# EasyEDA Pro project TeensySensorBoardV2.eprj, board PCB1
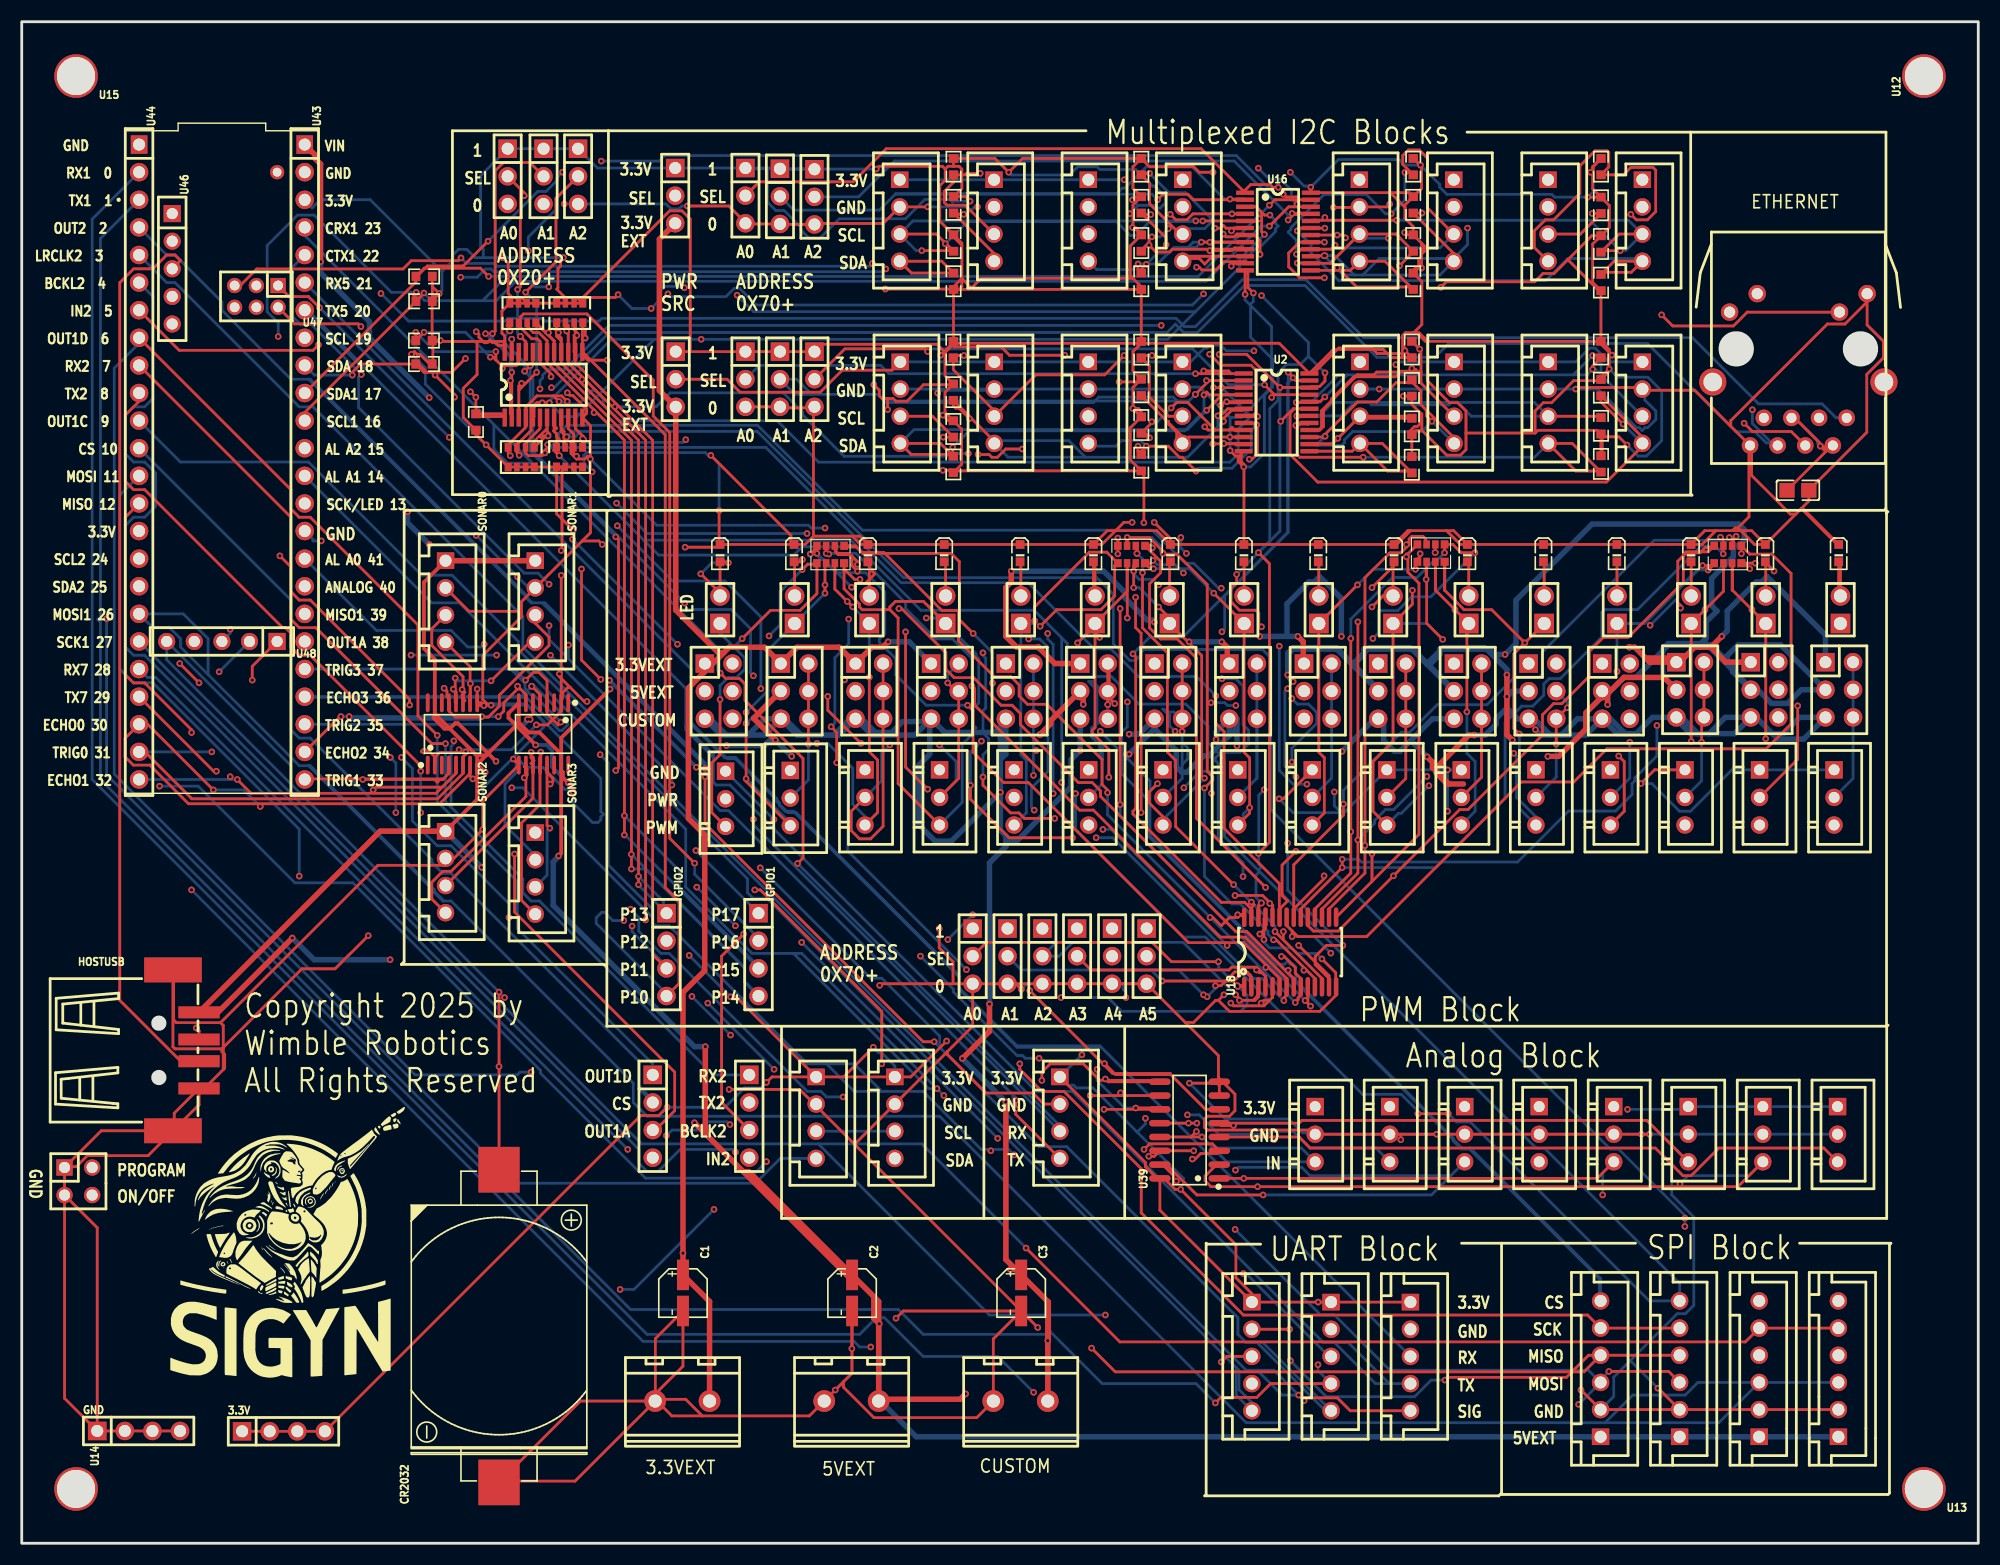
[diagram p9: board, top side]
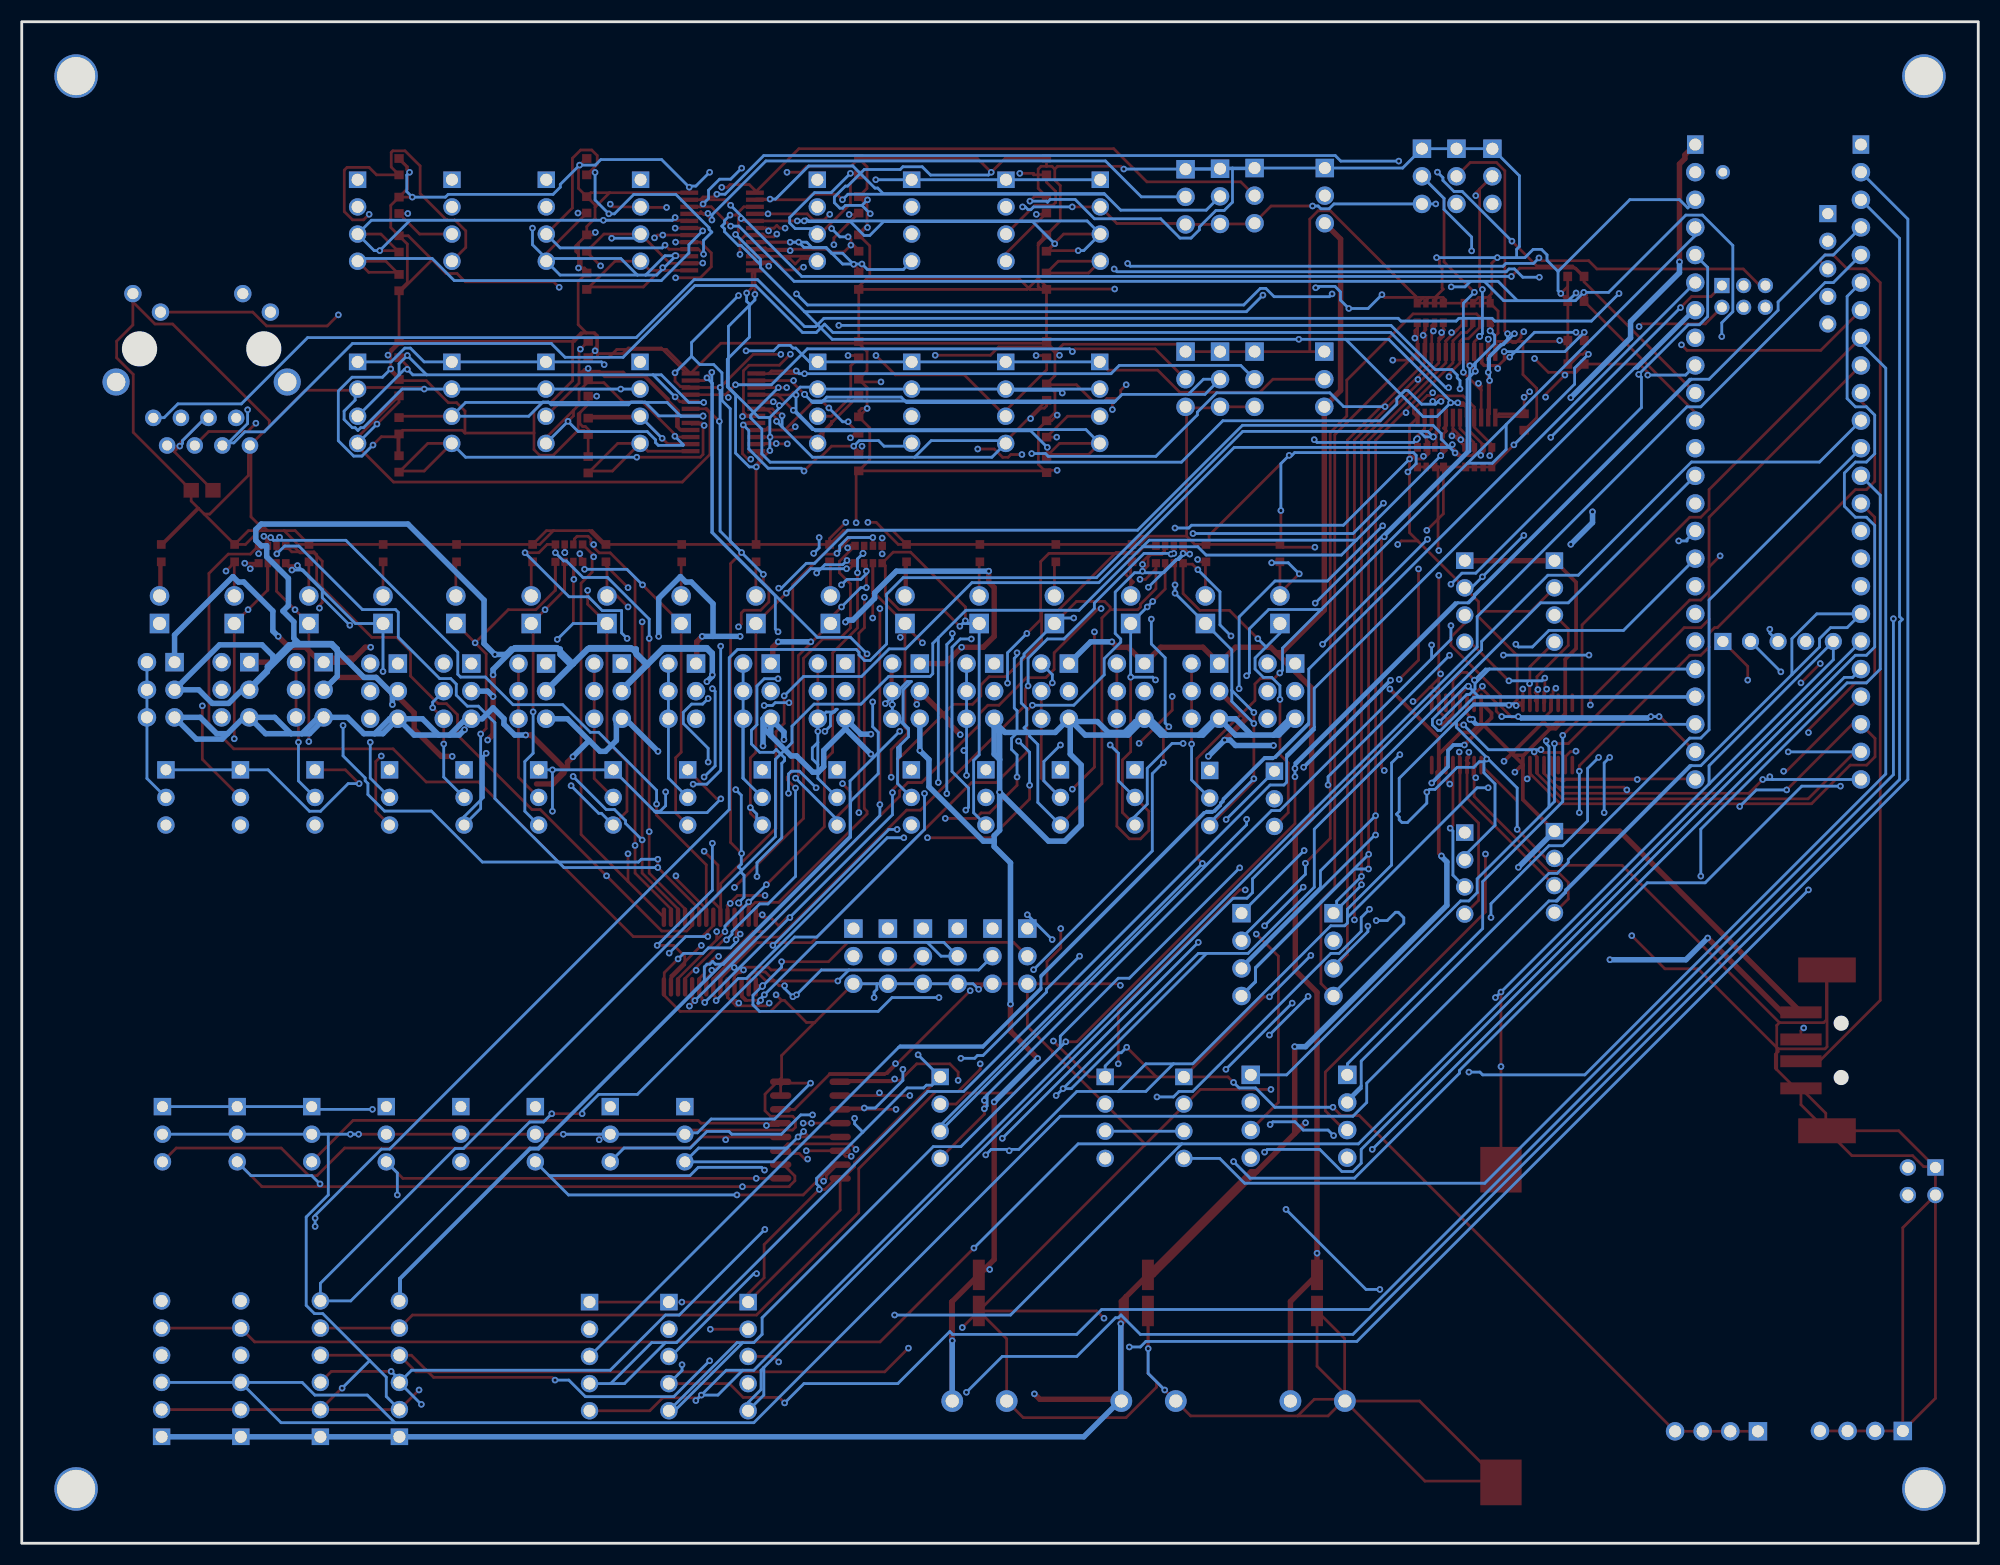
[diagram p10: board, bottom side, seen from below]

Outline 180 x 140 mm; copper layers: Top Layer, Inner1, Inner2, Bottom Layer. Coordinates in mm from the lower left corner of the outline.
Outline path: rectangle 0,140 180,0
Stack: Top Layer 0.035mm Outer layer thickness 1oz / Dielectric1 0.2104mm 7628 RC49% 8.6mil / Inner1 0.0152mm Inner layer thickness / Dielectric2 1.065mm 1.1mm H/HOZ Copper / Inner2 0.0152mm Inner layer thickness / Dielectric3 0.2104mm 7628 RC49% 8.6mil / Bottom Layer 0.035mm Outer layer thickness 1oz

## Design rules (mm)
template: Custom Config
spacing copperThickness1oz (default): track to track 0.102, other pairs 0.152 to 0.3
spacing copperThickness2oz: track to track 0.203, other pairs 0.152 to 0.3
track width copperThickness1oz (default): min 0.127, default 0.254, max 2.54
track width copperThickness2oz: min 0.203, default 0.254, max 2.54
track width trackWidth1: min 0.127, default 0.5, max 2.54
differential pair differentialPair (default): width min 0.127, default 0.254, max 2.54; gap min 0.152, default 0.152
via viaSize (default): diameter min 0.5, default 0.61, max 10; hole min 0.3, default 0.305, max 6.3
net class Power uses trackWidth1
net 3.3VEXT uses trackWidth1
net 5VEXT uses trackWidth1
net CUST uses trackWidth1

## Placement (name value [footprint] x y rotation side)
3.3V  PZ254V-11-04P  [HDR-TH_4P-P2.54-V-M]  24.08 10.3 0 top
3.3VEXT  WJ127-5.0-2P  [CONN-TH_2P-P5.00_CPC3703CTR]  60.77 13.09 0 top
5VEXT  WJ127-5.0-2P  [CONN-TH_2P-P5.00_CPC3703CTR]  76.33 13.09 0 top
C1  10uF  [CAP-SMD_BD4.0-L4.3-W4.3-LS5.0-FD]  60.83 23.03 270 top
C2  10uF  [CAP-SMD_BD4.0-L4.3-W4.3-LS5.0-FD]  76.39 23.03 270 top
C3  10uF  [CAP-SMD_BD4.0-L4.3-W4.3-LS5.0-FD]  91.95 23.03 270 top
C4  100nF  [C0805]  163.41 96.89 0 top
CN10  ZX-XH2.54-4PZZ  [CONN-TH_4P-P2.50_4PIN]  95.5 39.16 270 top
CN11  ZX-XH2.54-4PZZ  [CONN-TH_4P-P2.50_4PIN]  73.09 39.16 270 top
CN12  ZX-XH2.54-4PZZ  [CONN-TH_4P-P2.50_4PIN]  80.32 39.16 270 top
CN14  ZX-XH2.54-4PZZ  [CONN-TH_4P-P2.50_4PIN]  80.82 104.95 270 top
CN15  ZX-XH2.54-4PZZ  [CONN-TH_4P-P2.50_4PIN]  89.47 104.95 270 top
CN16  ZX-XH2.54-4PZZ  [CONN-TH_4P-P2.50_4PIN]  98.12 104.95 270 top
CN17  ZX-XH2.54-4PZZ  [CONN-TH_4P-P2.50_4PIN]  106.78 104.95 270 top
CN18  ZX-XH2.54-4PZZ  [CONN-TH_4P-P2.50_4PIN]  123.11 104.95 270 top
CN19  ZX-XH2.54-4PZZ  [CONN-TH_4P-P2.50_4PIN]  131.78 104.95 270 top
CN20  ZX-XH2.54-4PZZ  [CONN-TH_4P-P2.50_4PIN]  140.44 104.95 270 top
CN21  ZX-XH2.54-4PZZ  [CONN-TH_4P-P2.50_4PIN]  149.1 104.95 270 top
CN56  ZX-XH2.54-3PZZ  [CONN-TH_3P-P2.54_2501S-3P]  167.05 37.64 270 top
CN57  ZX-XH2.54-3PZZ  [CONN-TH_3P-P2.54_2501S-3P]  160.18 37.64 270 top
CN58  ZX-XH2.54-3PZZ  [CONN-TH_3P-P2.54_2501S-3P]  153.32 37.64 270 top
CN59  ZX-XH2.54-3PZZ  [CONN-TH_3P-P2.54_2501S-3P]  146.46 37.64 270 top
CN60  ZX-XH2.54-3PZZ  [CONN-TH_3P-P2.54_2501S-3P]  139.6 37.64 270 top
CN61  ZX-XH2.54-3PZZ  [CONN-TH_3P-P2.54_2501S-3P]  132.75 37.64 270 top
CN62  ZX-XH2.54-3PZZ  [CONN-TH_3P-P2.54_2501S-3P]  125.86 37.64 270 top
CN63  ZX-XH2.54-3PZZ  [CONN-TH_3P-P2.54_2501S-3P]  118.99 37.64 270 top
CN64  ZX-XH2.54-4PZZ  [CONN-TH_4P-P2.50_4PIN]  80.77 121.71 270 top
CN65  ZX-XH2.54-4PZZ  [CONN-TH_4P-P2.50_4PIN]  89.45 121.71 270 top
CN66  ZX-XH2.54-4PZZ  [CONN-TH_4P-P2.50_4PIN]  98.13 121.71 270 top
CN67  ZX-XH2.54-4PZZ  [CONN-TH_4P-P2.50_4PIN]  106.81 121.71 270 top
CN68  ZX-XH2.54-4PZZ  [CONN-TH_4P-P2.50_4PIN]  123.06 121.71 270 top
CN69  ZX-XH2.54-4PZZ  [CONN-TH_4P-P2.50_4PIN]  131.74 121.71 270 top
CN70  ZX-XH2.54-4PZZ  [CONN-TH_4P-P2.50_4PIN]  140.42 121.71 270 top
CN71  ZX-XH2.54-4PZZ  [CONN-TH_4P-P2.50_4PIN]  149.1 121.71 270 top
CN72  ZX-XH2.54-3PZZ  [CONN-TH_3P-P2.54_2501S-3P]  64.75 68.5 270 top
CN73  ZX-XH2.54-3PZZ  [CONN-TH_3P-P2.54_2501S-3P]  70.71 68.57 270 top
CN74  ZX-XH2.54-3PZZ  [CONN-TH_3P-P2.54_2501S-3P]  77.58 68.63 270 top
CN75  ZX-XH2.54-3PZZ  [CONN-TH_3P-P2.54_2501S-3P]  84.44 68.63 270 top
CN76  ZX-XH2.54-3PZZ  [CONN-TH_3P-P2.54_2501S-3P]  91.3 68.63 270 top
CN77  ZX-XH2.54-3PZZ  [CONN-TH_3P-P2.54_2501S-3P]  98.16 68.63 270 top
CN78  ZX-XH2.54-3PZZ  [CONN-TH_3P-P2.54_2501S-3P]  105 68.63 270 top
CN79  ZX-XH2.54-3PZZ  [CONN-TH_3P-P2.54_2501S-3P]  111.87 68.63 270 top
CN80  ZX-XH2.54-3PZZ  [CONN-TH_3P-P2.54_2501S-3P]  118.73 68.63 270 top
CN81  ZX-XH2.54-3PZZ  [CONN-TH_3P-P2.54_2501S-3P]  125.59 68.63 270 top
CN82  ZX-XH2.54-3PZZ  [CONN-TH_3P-P2.54_2501S-3P]  132.44 68.63 270 top
CN83  ZX-XH2.54-3PZZ  [CONN-TH_3P-P2.54_2501S-3P]  139.3 68.63 270 top
CN84  ZX-XH2.54-3PZZ  [CONN-TH_3P-P2.54_2501S-3P]  146.16 68.63 270 top
CN85  ZX-XH2.54-3PZZ  [CONN-TH_3P-P2.54_2501S-3P]  153.02 68.63 270 top
CN86  ZX-XH2.54-3PZZ  [CONN-TH_3P-P2.54_2501S-3P]  159.88 68.63 270 top
CN87  ZX-XH2.54-3PZZ  [CONN-TH_3P-P2.54_2501S-3P]  166.74 68.63 270 top
CR2032  CR2032-BS-6  [BAT-TH_CR2032-BS-6-1]  43.91 19.99 90 top
CUSTOM  WJ127-5.0-2P  [CONN-TH_2P-P5.00_CPC3703CTR]  91.89 13.09 0 top
ETHERNET  J1B1211CCD  [RJ45-TH_J1B1211CCD]  163.45 108 180 top
F1  220Ω  [RES-ARRAY-SMD_0603-8P-L3.2-W1.6-TL]  74.41 90.98 90 top
F2  220Ω  [RES-ARRAY-SMD_0603-8P-L3.2-W1.6-TL]  102.09 90.98 90 top
F3  220Ω  [RES-ARRAY-SMD_0603-8P-L3.2-W1.6-TL]  129.65 91.11 90 top
F4  220Ω  [RES-ARRAY-SMD_0603-8P-L3.2-W1.6-TL]  156.96 90.98 90 top
GND  PZ254V-11-04P  [HDR-TH_4P-P2.54-V-M]  10.75 10.33 0 top
GPIO1  PZ254V-11-04P  [HDR-TH_4P-P2.54-V-M]  67.78 54.16 270 top
GPIO2  PZ254V-11-04P  [HDR-TH_4P-P2.54-V-M]  59.32 54.16 270 top
H2  PH-00013  [HDR-TH_2P-P2.54-V-M-R2-C1-S2.54]  71.1 85.9 0 top
H3  PH-00013  [HDR-TH_2P-P2.54-V-M-R2-C1-S2.54]  64.25 85.9 0 top
H4  PH-00013  [HDR-TH_2P-P2.54-V-M-R2-C1-S2.54]  77.98 85.9 0 top
H5  PH-00013  [HDR-TH_2P-P2.54-V-M-R2-C1-S2.54]  85 85.9 0 top
H6  PH-00013  [HDR-TH_2P-P2.54-V-M-R2-C1-S2.54]  91.92 85.9 0 top
H7  PH-00013  [HDR-TH_2P-P2.54-V-M-R2-C1-S2.54]  98.74 85.9 0 top
H8  PH-00013  [HDR-TH_2P-P2.54-V-M-R2-C1-S2.54]  105.6 85.9 0 top
H9  PH-00013  [HDR-TH_2P-P2.54-V-M-R2-C1-S2.54]  112.46 85.9 0 top
H10  PH-00013  [HDR-TH_2P-P2.54-V-M-R2-C1-S2.54]  119.33 85.9 0 top
H11  PH-00013  [HDR-TH_2P-P2.54-V-M-R2-C1-S2.54]  126.16 85.9 0 top
H12  PH-00013  [HDR-TH_2P-P2.54-V-M-R2-C1-S2.54]  133.13 85.9 0 top
H13  PH-00013  [HDR-TH_2P-P2.54-V-M-R2-C1-S2.54]  140.06 85.9 0 top
H14  PH-00013  [HDR-TH_2P-P2.54-V-M-R2-C1-S2.54]  146.76 85.9 0 top
H15  PH-00013  [HDR-TH_2P-P2.54-V-M-R2-C1-S2.54]  153.59 85.9 0 top
H16  PH-00013  [HDR-TH_2P-P2.54-V-M-R2-C1-S2.54]  160.45 85.9 0 top
H17  PH-00013  [HDR-TH_2P-P2.54-V-M-R2-C1-S2.54]  167.32 85.9 0 top
H18  HX PZ2.54-2x2P ZZ  [HDR-TH_HX-PZ2.54-2X2P-ZZ]  5.21 33.31 270 top
H19  PZ254V-11-04P  [HDR-TH_4P-P2.54-V-M]  66.93 39.29 270 top
H20  PZ254V-11-04P  [HDR-TH_4P-P2.54-V-M]  58.06 39.29 270 top
HOSTUSB  BX-TYPE-A-MWT4P  [USB-A-SMD_BX-TYPE-A-MWT4P]  15.11 45.35 270 top
I2C1-A0  PZ254V-11-03P  [HDR-TH_3P-P2.54-V-M]  66.58 107.11 270 top
I2C1-A1  PZ254V-11-03P  [HDR-TH_3P-P2.54-V-M]  69.75 107.11 270 top
I2C1-A2  PZ254V-11-03P  [HDR-TH_3P-P2.54-V-M]  72.93 107.11 270 top
I2C1-PWR  PZ254V-11-03P  [HDR-TH_3P-P2.54-V-M]  60.17 107.11 270 top
I2C2-A0  PZ254V-11-03P  [HDR-TH_3P-P2.54-V-M]  66.58 124 270 top
I2C2-A1  PZ254V-11-03P  [HDR-TH_3P-P2.54-V-M]  69.75 123.93 270 top
I2C2-A2  PZ254V-11-03P  [HDR-TH_3P-P2.54-V-M]  72.93 123.89 270 top
I2C2-PWR  PZ254V-11-03P  [HDR-TH_3P-P2.54-V-M]  60.12 124 270 top
I2CX-A0  PZ254V-11-03P  [HDR-TH_3P-P2.54-V-M]  44.7 125.78 270 top
I2CX-A1  PZ254V-11-03P  [HDR-TH_3P-P2.54-V-M]  48.01 125.78 270 top
I2CX-A2  PZ254V-11-03P  [HDR-TH_3P-P2.54-V-M]  51.18 125.78 270 top
LED1  19-219/GHC-YR2T1B5Y/3T  [LED-SMD_L1.6-W0.8_19-219-GHC-YR2T1B5Y-3T]  71.06 91.11 270 top
LED2  19-219/GHC-YR2T1B5Y/3T  [LED-SMD_L1.6-W0.8_19-219-GHC-YR2T1B5Y-3T]  64.25 91.11 270 top
LED3  19-219/GHC-YR2T1B5Y/3T  [LED-SMD_L1.6-W0.8_19-219-GHC-YR2T1B5Y-3T]  77.85 91.11 270 top
LED4  19-219/GHC-YR2T1B5Y/3T  [LED-SMD_L1.6-W0.8_19-219-GHC-YR2T1B5Y-3T]  84.87 91.11 270 top
LED5  19-219/GHC-YR2T1B5Y/3T  [LED-SMD_L1.6-W0.8_19-219-GHC-YR2T1B5Y-3T]  91.85 91.11 270 top
LED6  19-219/GHC-YR2T1B5Y/3T  [LED-SMD_L1.6-W0.8_19-219-GHC-YR2T1B5Y-3T]  98.6 91.11 270 top
LED7  19-219/GHC-YR2T1B5Y/3T  [LED-SMD_L1.6-W0.8_19-219-GHC-YR2T1B5Y-3T]  105.68 91.11 270 top
LED8  19-219/GHC-YR2T1B5Y/3T  [LED-SMD_L1.6-W0.8_19-219-GHC-YR2T1B5Y-3T]  112.44 91.11 270 top
LED9  19-219/GHC-YR2T1B5Y/3T  [LED-SMD_L1.6-W0.8_19-219-GHC-YR2T1B5Y-3T]  119.28 91.11 270 top
LED10  19-219/GHC-YR2T1B5Y/3T  [LED-SMD_L1.6-W0.8_19-219-GHC-YR2T1B5Y-3T]  126.25 91.11 270 top
LED11  19-219/GHC-YR2T1B5Y/3T  [LED-SMD_L1.6-W0.8_19-219-GHC-YR2T1B5Y-3T]  133 91.11 270 top
LED12  19-219/GHC-YR2T1B5Y/3T  [LED-SMD_L1.6-W0.8_19-219-GHC-YR2T1B5Y-3T]  140 91.11 270 top
LED13  19-219/GHC-YR2T1B5Y/3T  [LED-SMD_L1.6-W0.8_19-219-GHC-YR2T1B5Y-3T]  146.75 91.11 270 top
LED14  19-219/GHC-YR2T1B5Y/3T  [LED-SMD_L1.6-W0.8_19-219-GHC-YR2T1B5Y-3T]  153.57 91.11 270 top
LED15  19-219/GHC-YR2T1B5Y/3T  [LED-SMD_L1.6-W0.8_19-219-GHC-YR2T1B5Y-3T]  160.42 91.11 270 top
LED16  19-219/GHC-YR2T1B5Y/3T  [LED-SMD_L1.6-W0.8_19-219-GHC-YR2T1B5Y-3T]  167.16 91.11 270 top
PWM-A0  PZ254V-11-03P  [HDR-TH_3P-P2.54-V-M]  87.49 54.02 270 top
PWM-A1  PZ254V-11-03P  [HDR-TH_3P-P2.54-V-M]  90.69 54.02 270 top
PWM-A2  PZ254V-11-03P  [HDR-TH_3P-P2.54-V-M]  93.9 54.02 270 top
PWM-A3  PZ254V-11-03P  [HDR-TH_3P-P2.54-V-M]  97.09 54.02 270 top
PWM-A4  PZ254V-11-03P  [HDR-TH_3P-P2.54-V-M]  100.31 54.02 270 top
PWM-A5  PZ254V-11-03P  [HDR-TH_3P-P2.54-V-M]  103.49 54.02 270 top
R1  3kΩ  [R0603]  85.71 99.26 90 top
R2  3kΩ  [R0603]  85.71 102.53 270 top
R3  3kΩ  [R0603]  85.71 105.92 270 top
R4  3kΩ  [R0603]  85.71 109.83 270 top
R5  3kΩ  [R0603]  103 99.43 90 top
R6  3kΩ  [R0603]  103 102.89 270 top
R7  3kΩ  [R0603]  103 106.36 270 top
R8  3kΩ  [R0603]  103 109.83 270 top
R9  3kΩ  [R0603]  145.29 109.84 90 top
R10  3kΩ  [R0603]  145.29 106.33 90 top
R11  3kΩ  [R0603]  145.29 102.82 270 top
R12  3kΩ  [R0603]  145.29 99.31 90 top
R13  3kΩ  [R0603]  127.89 109.84 270 top
R14  3kΩ  [R0603]  127.89 106.31 270 top
R15  3kΩ  [R0603]  127.89 102.77 270 top
R16  3kΩ  [R0603]  127.89 99.24 90 top
R17  3kΩ  [R0603]  37 110.66 0 top
R18  3kΩ  [R0603]  37 108.5 0 top
R35  3kΩ  [R0603]  85.72 116.12 90 top
R36  3kΩ  [R0603]  85.72 119.64 270 top
R37  3kΩ  [R0603]  85.72 123.15 270 top
R38  3kΩ  [R0603]  85.72 126.66 270 top
R39  3kΩ  [R0603]  103 116.12 90 top
R40  3kΩ  [R0603]  103 119.64 270 top
R41  3kΩ  [R0603]  103 123.15 270 top
R42  3kΩ  [R0603]  145.29 119.55 90 top
R43  3kΩ  [R0603]  145.29 116 270 top
R44  3kΩ  [R0603]  145.29 123.11 90 top
R45  3kΩ  [R0603]  145.29 126.66 90 top
R46  3kΩ  [R0603]  128.02 126.66 90 top
R47  3kΩ  [R0603]  128.02 123.15 90 top
R48  3kΩ  [R0603]  128.02 119.64 90 top
R49  3kΩ  [R0603]  128.02 116.12 90 top
R50  3kΩ  [R0603]  103 126.66 270 top
R51  3kΩ  [R0603]  41.78 103.17 270 top
R52  3kΩ  [R0603]  37.02 114.28 0 top
R53  3kΩ  [R0603]  37.02 116.56 0 top
RN1  10kΩ  [RES-ARRAY-SMD_0603-8P-L3.2-W1.6-BL]  45.95 99.93 0 top
RN2  10kΩ  [RES-ARRAY-SMD_0603-8P-L3.2-W1.6-BL]  50.39 99.93 0 top
RN3  10kΩ  [RES-ARRAY-SMD_0603-8P-L3.2-W1.6-BL]  50.42 113.2 180 top
RN4  10kΩ  [RES-ARRAY-SMD_0603-8P-L3.2-W1.6-BL]  46.1 113.2 180 top
SONAR0  ZX-XH2.54-4PZZ  [CONN-TH_4P-P2.50_4PIN]  38.99 86.66 270 top
SONAR1  ZX-XH2.54-4PZZ  [CONN-TH_4P-P2.50_4PIN]  47.24 86.66 270 top
SONAR2  ZX-XH2.54-4PZZ  [CONN-TH_4P-P2.50_4PIN]  38.99 61.77 270 top
SONAR3  ZX-XH2.54-4PZZ  [CONN-TH_4P-P2.50_4PIN]  47.24 61.64 270 top
U2  TCA9548APWR  [TSSOP-24_L7.8-W4.4-P0.65-LS6.4-BL]  115.44 104.06 270 top
U4  ZX-XH2.54-6PZZ  [CONN-TH_6P-P2.50_ZX-XH2.54-6PZZ]  152.53 16.05 270 top
U5  ZX-XH2.54-5PZZ  [CONN-TH_5P-P2.50_ZX-XH2.54-5PZZ]  113.17 17.19 270 top
U6  ZX-XH2.54-5PZZ  [CONN-TH_5P-P2.50_ZX-XH2.54-5PZZ]  120.46 17.19 270 top
U8  ZX-XH2.54-6PZZ  [CONN-TH_6P-P2.50_ZX-XH2.54-6PZZ]  145.25 16.05 270 top
U12  -  [3.5mm_Hole]  175 135 90 top
U13  -  [3.5mm_Hole]  175 5 180 top
U14  -  [3.5mm_Hole]  5 5 270 top
U15  -  [3.5mm_Hole]  5 135 180 top
U16  TCA9548APWR  [TSSOP-24_L7.8-W4.4-P0.65-LS6.4-BL]  115.57 120.7 270 top
U17  TCA9535PWR  [TSSOP-24_L7.8-W4.4-P0.65-LS6.4-BL]  48.01 106.6 0 top
U18  PCA9685PW,118  [TSSOP-28_L9.7-W4.4-P0.65-LS6.4-TL]  116.7 54.4 90 top
U19  BX-PZ2.54-2-3PZZ  [HDR-TH_6P-P2.54-V-M-R2-C3-S2.54]  64.12 78.41 270 top
U20  BX-PZ2.54-2-3PZZ  [HDR-TH_6P-P2.54-V-M-R2-C3-S2.54]  71.1 78.41 270 top
U21  BX-PZ2.54-2-3PZZ  [HDR-TH_6P-P2.54-V-M-R2-C3-S2.54]  77.98 78.41 270 top
U22  BX-PZ2.54-2-3PZZ  [HDR-TH_6P-P2.54-V-M-R2-C3-S2.54]  84.93 78.41 270 top
U23  BX-PZ2.54-2-3PZZ  [HDR-TH_6P-P2.54-V-M-R2-C3-S2.54]  91.81 78.41 270 top
U24  BX-PZ2.54-2-3PZZ  [HDR-TH_6P-P2.54-V-M-R2-C3-S2.54]  98.65 78.41 270 top
U25  BX-PZ2.54-2-3PZZ  [HDR-TH_6P-P2.54-V-M-R2-C3-S2.54]  105.49 78.41 270 top
U26  BX-PZ2.54-2-3PZZ  [HDR-TH_6P-P2.54-V-M-R2-C3-S2.54]  112.36 78.41 270 top
U27  BX-PZ2.54-2-3PZZ  [HDR-TH_6P-P2.54-V-M-R2-C3-S2.54]  119.24 78.41 270 top
U28  BX-PZ2.54-2-3PZZ  [HDR-TH_6P-P2.54-V-M-R2-C3-S2.54]  126.06 78.41 270 top
U29  BX-PZ2.54-2-3PZZ  [HDR-TH_6P-P2.54-V-M-R2-C3-S2.54]  133.03 78.41 270 top
U30  BX-PZ2.54-2-3PZZ  [HDR-TH_6P-P2.54-V-M-R2-C3-S2.54]  139.91 78.41 270 top
U31  BX-PZ2.54-2-3PZZ  [HDR-TH_6P-P2.54-V-M-R2-C3-S2.54]  146.67 78.41 270 top
U32  BX-PZ2.54-2-3PZZ  [HDR-TH_6P-P2.54-V-M-R2-C3-S2.54]  153.5 78.53 270 top
U33  BX-PZ2.54-2-3PZZ  [HDR-TH_6P-P2.54-V-M-R2-C3-S2.54]  160.34 78.53 270 top
U34  BX-PZ2.54-2-3PZZ  [HDR-TH_6P-P2.54-V-M-R2-C3-S2.54]  167.21 78.53 270 top
U35  TXB0106PWR  [TSSOP-16_L5.0-W4.4-P0.65-LS6.4-BL]  39.62 74.47 0 top
U36  TXB0106PWR  [TSSOP-16_L5.0-W4.4-P0.65-LS6.4-BL]  48.01 74.47 180 top
U37  Teensy 4.1  [MODULE_DEV-16771]  18.42 99.49 270 top
U39  CD74HC4051M96  [SOIC-16_L9.9-W3.9-P1.27-LS6.0-BL]  107.44 38.02 90 top
U40  ZX-XH2.54-6PZZ  [CONN-TH_6P-P2.50_ZX-XH2.54-6PZZ]  167.13 16.05 270 top
U41  ZX-XH2.54-6PZZ  [CONN-TH_6P-P2.50_ZX-XH2.54-6PZZ]  159.84 16.05 270 top
U42  ZX-XH2.54-5PZZ  [CONN-TH_5P-P2.50_ZX-XH2.54-5PZZ]  127.76 17.19 270 top
U43  HC-PM254-8.5H-1x24PZ  [HDR-TH_24P-P2.54-V-F]  26.03 99.49 270 top
U44  HC-PM254-8.5H-1x24PZ  [HDR-TH_24P-P2.54-V-F]  10.8 99.49 270 top
U46  PM2.54-1*5  [HDR-TH_5P-P2.54-V-F]  13.84 117.27 270 top
U47  2.0-2*3P母  [HDR-TH_6P-P2.00-V-F-R2-C3-S2.00]  21.58 114.73 180 top
U48  PM2.54-1*5  [HDR-TH_5P-P2.54-V-F]  18.42 82.98 180 top

## Footprints (pads in the part's own frame, mm; a bottom-side part is the same pattern mirrored in y, then rotated)
3.5mm_Hole
  round 4 hole 3.5: 3(0,0)
BAT-TH_CR2032-BS-6-1
  rect 4.2x3.8 smd: 1(14.385,0) 2(-14.385,0)
C0805
  rect 1.41x1.35 smd: 1(-1,0) 2(1,0)
CAP-SMD_BD4.0-L4.3-W4.3-LS5.0-FD
  rect 2.8x1.1 smd: 1(-1.661,0) 2(1.661,0)
CONN-TH_2P-P5.00_CPC3703CTR
  round 2 hole 1.2: 1(-2.505,0) 2(2.505,0)
CONN-TH_3P-P2.54_2501S-3P
  rect 1.6x1.6 hole 1: 1(-2.54,0)
  round 1.6 hole 1: 2(0,0) 3(2.54,0)
CONN-TH_4P-P2.50_4PIN
  rect 1.524x1.6 hole 1.1: 1(-3.75,0)
  round 1.6 hole 1.1: 2(-1.25,0) 3(1.25,0) 4(3.75,0)
CONN-TH_5P-P2.50_ZX-XH2.54-5PZZ
  rect 1.524x1.6 hole 1.1: 1(-5,0)
  round 1.6 hole 1.1: 2(-2.5,0) 3(0,0) 4(2.5,0) 5(5,0)
CONN-TH_6P-P2.50_ZX-XH2.54-6PZZ
  rect 1.524x1.6 hole 1.1: 1(6.25,0)
  round 1.6 hole 1.1: 2(3.75,0) 3(1.25,0) 4(-1.25,0) 5(-3.75,0) 6(-6.25,0)
HDR-TH_2P-P2.54-V-M-R2-C1-S2.54
  rect 1.8x1.8 hole 1.2: 1(0,-1.27)
  round 1.8 hole 1.2: 2(0,1.27)
HDR-TH_3P-P2.54-V-M
  rect 1.7x1.7 hole 1.1: 1(-2.54,0)
  round 1.7 hole 1.1: 2(0,0) 3(2.54,0)
HDR-TH_4P-P2.54-V-M
  rect 1.7x1.7 hole 1.1: 1(-3.81,0)
  round 1.7 hole 1.1: 2(-1.27,0) 3(1.27,0) 4(3.81,0)
HDR-TH_5P-P2.54-V-F
  rect 1.575x1.575 hole 1.02: 1(-5.08,0)
  round 1.575 hole 1.02: 2(-2.54,0) 3(0,0) 4(2.54,0) 5(5.08,0)
HDR-TH_6P-P2.00-V-F-R2-C3-S2.00
  rect 1.4x1.4 hole 0.9: 1(-2,-1)
  round 1.4 hole 0.9: 2(-2,1) 3(0,-1) 4(0,1) 5(2,-1) 6(2,1)
HDR-TH_6P-P2.54-V-M-R2-C3-S2.54
  rect 1.7x1.7 hole 1.1: 1(-2.54,-1.27)
  round 1.7 hole 1.1: 2(-2.54,1.27) 3(0,-1.27) 4(0,1.27) 5(2.54,-1.27) 6(2.54,1.27)
HDR-TH_24P-P2.54-V-F
  rect 1.7x1.524 hole 1.1: 1(-29.21,0)
  round 1.7 hole 1.1: 2(-26.67,0) 3(-24.13,0) 4(-21.59,0) 5(-19.05,0) 6(-16.51,0) 7(-13.97,0) 8(-11.43,0) 9(-8.89,0) 10(-6.35,0) 11(-3.81,0) 12(-1.27,0) 13(1.27,0) 14(3.81,0) 15(6.35,0) 16(8.89,0) 17(11.43,0) 18(13.97,0) 19(16.51,0) 20(19.05,0) 21(21.59,0) 22(24.13,0) 23(26.67,0) 24(29.21,0)
HDR-TH_HX-PZ2.54-2X2P-ZZ
  rect 1.5x1.5 hole 1.02: 1(-1.27,-1.27)
  round 1.5 hole 1.02: 2(-1.27,1.27) 3(1.27,-1.27) 4(1.27,1.27)
LED-SMD_L1.6-W0.8_19-219-GHC-YR2T1B5Y-3T
  rect 0.8x0.8 smd: 1(0.799,0) 2(-0.799,0)
MODULE_DEV-16771
  round 1.308 hole 0.8: 0(-26.67,-7.62) 1(-24.13,-7.62) 2(-21.59,-7.62) 3(-19.05,-7.62) 3.3V_1(6.35,-7.62) 3.3V_2(-24.13,7.62) 3.3V_3(16.51,-2.54) 4(-16.51,-7.62) 5(-13.97,-7.62) 6(-11.43,-7.62) 7(-8.89,-7.62) 8(-6.35,-7.62) 9(-3.81,-7.62) 10(-1.27,-7.62) 11(1.27,-7.62) 12(3.81,-7.62) 13(3.81,7.62) 14(1.27,7.62) 15(-1.27,7.62) 16(-3.81,7.62) 17(-6.35,7.62) 18(-8.89,7.62) 19(-11.43,7.62) 20(-13.97,7.62) 21(-16.51,7.62) 22(-19.05,7.62) 23(-21.59,7.62) 24(8.89,-7.62) 25(11.43,-7.62) 26(13.97,-7.62) 27(16.51,-7.62) 28(19.05,-7.62) 29(21.59,-7.62) 30(24.13,-7.62) 31(26.67,-7.62) 32(29.21,-7.62) 33(29.21,7.62) 34(26.67,7.62) 35(24.13,7.62) 36(21.59,7.62) 37(19.05,7.62) 38(16.51,7.62) 39(13.97,7.62) 40(11.43,7.62) 41(8.89,7.62) GND1(-29.21,-7.62) GND2(6.35,7.62) GND3(-26.67,7.62) GND4(16.51,0) ON/OFF(16.51,5.08) PROGRAM(16.51,2.54) VBAT(16.51,-5.08) VIN(-29.21,7.62) VUSB(-26.67,5.08)
  round 1.258 hole 0.75: 5V(-22.86,-4.57) D+(-17.78,-4.57) D-(-20.32,-4.57) USB_GND1(-15.24,-4.57) USB_GND2(-12.7,-4.57)
  round 1.208 hole 0.7: GND5(-14.24,3.17) LED(-16.24,3.17) R+(-16.24,5.17) R-(-14.24,5.17) T+(-14.24,1.17) T-(-16.24,1.17)
R0603
  rect 0.806x0.864 smd: 1(-0.753,0) 2(0.753,0)
RES-ARRAY-SMD_0603-8P-L3.2-W1.6-BL
  rect 0.65x0.8 smd: 1(-1.2,-0.9) 4(1.2,-0.9) 5(1.2,0.9) 8(-1.2,0.9)
  rect 0.5x0.8 smd: 2(-0.4,-0.9) 3(0.4,-0.9) 6(0.4,0.9) 7(-0.4,0.9)
RES-ARRAY-SMD_0603-8P-L3.2-W1.6-TL
  rect 0.75x0.7 smd: 1(-0.8,1.25) 5(0.8,-1.25) 8(0.8,1.25)
  rect 0.75x0.6 smd: 2(-0.8,0.4) 3(-0.8,-0.4) 6(0.8,-0.4) 7(0.8,0.4)
  rect 0.75x0.75 smd: 4(-0.8,-1.25)
RJ45-TH_J1B1211CCD
  round 1.524 hole 0.914: 1(-4.445,4.445) 2(-3.175,6.985) 3(-1.905,4.445) 4(-0.635,6.985) 5(0.635,4.445) 6(1.905,6.985) 7(3.175,4.445) 8(4.445,6.985)
  round 1.6 hole 1.02: 9(-6.325,-6.985) 10(-3.785,-5.285) 11(3.785,-6.985) 12(6.325,-5.285)
  round 2.5 hole 1.7: 13(-7.875,1.145) 14(7.875,1.145)
SOIC-16_L9.9-W3.9-P1.27-LS6.0-BL
  oval 0.602x1.971 smd: 1(-4.445,-2.736) 2(-3.175,-2.736) 3(-1.905,-2.736) 4(-0.635,-2.736) 5(0.635,-2.736) 6(1.905,-2.736) 7(3.175,-2.736) 8(4.445,-2.736) 9(4.445,2.736) 10(3.175,2.736) 11(1.905,2.736) 12(0.635,2.736) 13(-0.635,2.736) 14(-1.905,2.736) 15(-3.175,2.736) 16(-4.445,2.736)
TSSOP-16_L5.0-W4.4-P0.65-LS6.4-BL
  oval 0.343x1.732 smd: 1(-2.275,-2.866) 2(-1.625,-2.866) 3(-0.975,-2.866) 4(-0.325,-2.866) 5(0.325,-2.866) 6(0.975,-2.866) 7(1.625,-2.866) 8(2.275,-2.866) 9(2.275,2.866) 10(1.625,2.866) 11(0.975,2.866) 12(0.325,2.866) 13(-0.325,2.866) 14(-0.975,2.866) 15(-1.625,2.866) 16(-2.275,2.866)
TSSOP-24_L7.8-W4.4-P0.65-LS6.4-BL
  rect 0.4x1.65 smd: 1(-3.575,-3.022) 2(-2.925,-3.022) 3(-2.275,-3.022) 4(-1.625,-3.022) 5(-0.975,-3.022) 6(-0.325,-3.022) 7(0.325,-3.022) 8(0.975,-3.022) 9(1.625,-3.022) 10(2.275,-3.022) 11(2.925,-3.022) 12(3.575,-3.022) 13(3.575,3.022) 14(2.925,3.022) 15(2.275,3.022) 16(1.625,3.022) 17(0.975,3.022) 18(0.325,3.022) 19(-0.325,3.022) 20(-0.975,3.022) 21(-1.625,3.022) 22(-2.275,3.022) 23(-2.925,3.022) 24(-3.575,3.022)
TSSOP-28_L9.7-W4.4-P0.65-LS6.4-TL
  oval 1.804x0.406 smd: 1(-3.2,4.225) 2(-3.2,3.575) 3(-3.2,2.925) 4(-3.2,2.275) 5(-3.2,1.625) 6(-3.2,0.975) 7(-3.2,0.325) 8(-3.2,-0.325) 9(-3.2,-0.975) 10(-3.2,-1.625) 11(-3.2,-2.275) 12(-3.2,-2.925) 13(-3.2,-3.575) 14(-3.2,-4.225) 15(3.2,-4.225) 16(3.2,-3.575) 17(3.2,-2.925) 18(3.2,-2.275) 19(3.2,-1.625) 20(3.2,-0.975) 21(3.2,-0.325) 22(3.2,0.325) 23(3.2,0.975) 24(3.2,1.625) 25(3.2,2.275) 26(3.2,2.925) 27(3.2,3.575) 28(3.2,4.225)
USB-A-SMD_BX-TYPE-A-MWT4P
  rect 1.1x3.8 smd: 1(-3.5,1.2) 2(-1,1.2) 3(1,1.2) 4(3.5,1.2)
  rect 2.3x5.3 smd: 5(-7.4,-1.2) 6(7.4,-1.2)

## Nets
As in the schematic, except:
3.3V: 3.3V.1 3.3V.2 3.3V.3 3.3V.4 CN10.1 CN11.1 CN12.1 CN56.1 CN57.1 CN58.1 CN59.1 CN60.1 CN61.1 CN62.1 CN63.1 I2C1-A0.1 I2C1-A1.1 I2C1-A2.1 I2C1-PWR.1 I2C2-A0.1 I2C2-A1.1 I2C2-A2.1 I2C2-PWR.1 I2CX-A0.1 I2CX-A1.1 I2CX-A2.1 PWM-A0.1 PWM-A1.1 PWM-A2.1 PWM-A3.1 PWM-A4.1 PWM-A5.1 R1.1 R2.1 R3.1 R4.1 R5.1 R6.1 R7.1 R8.1 R9.2 R10.2 R11.2 R12.2 R13.2 R14.2 R15.2 R16.2 R17.2 R18.2 R35.1 R36.1 R37.1 R38.1 R39.1 R40.1 R41.1 R42.2 R43.2 R44.2 R45.2 R46.2 R47.2 R48.2 R49.2 R50.1 R51.2 R52.2 R53.2 RN1.1 RN1.2 RN1.3 RN1.4 RN2.1 RN2.2 RN2.3 RN2.4 RN3.1 RN3.2 RN3.3 RN3.4 RN4.1 RN4.2 RN4.3 RN4.4 U2.24 U5.1 U6.1 U16.24 U17.24 U18.28 U35.2 U36.2 U39.16 U42.1 U43.3 U44.15 U48.4
5VEXT: 5VEXT.2 C2.1 HOSTUSB.1 SONAR0.1 SONAR1.1 SONAR2.1 SONAR3.1 U4.1 U8.1 U19.3 U20.3 U21.3 U22.3 U23.3 U24.3 U25.3 U26.3 U27.3 U28.3 U29.3 U30.3 U31.3 U32.3 U33.3 U34.3 U35.8 U35.15 U36.8 U36.15 U37.VIN U40.1 U41.1
D+: U46.3
D-: U46.2
ON/OFF: U48.1
PROGRAM: U48.2
R+: ETHERNET.6 U37.R+ U47.1
R-: ETHERNET.4 U37.R- U47.2
USB_GND1: U46.4
USB_GND2: U46.5
$1N4572: HOSTUSB.3 U37.D+
$1N4583: HOSTUSB.2 U37.D-
$1N4831: H18.2 U37.PROGRAM
$1N4835: H18.4 U37.ON/OFF

Pads without a net: ETHERNET 7 11 12 13 14; H19 4; H20 4; U12 3; U13 3; U14 3; U15 3; U35 1 3 14 16; U36 1 3 14 16; U37 3.3V_1 3.3V_2 3.3V_3 GND1 GND2 GND3 GND4 GND5 USB_GND1 USB_GND2 VUSB; U46 1

## Via types
v1: diameter 0.61, hole 0.305, Top Layer to Bottom Layer, 782 vias

## Routing (per net, layer and track width the routed paths; a pad name or vN(x,y) marks a point on that pad's centre or on a via; arc(x,y) is an arc through that point)
3.3V: length 1541.5
  Top Layer w0.254: 85.63,106.6 82.96,106.6 81.44,105.08 80.42,105.08 80.17,105.33 79.66,105.33 ; 85.63,106.6 R3.1 84.95,107.43 84.95,109.56 ; 85.63,106.6 84.95,105.91 84.95,104.04 R2.1 ; 87.38,115.5 87.25,115.37 86.23,115.37 ; 87.38,115.5 88.26,116.39 102.24,116.39 ; 87.38,115.5 86.49,116.39 ; 87.38,115.5 87.5,115.37 R39.1 ; v1(102.19,121.07) 102.32,121.07 ; 102.32,121.07 102.24,121.15 102.24,123.14 102.95,123.86 ; 102.32,121.07 102.45,121.07 103,120.52 R40.1 ; 102.32,121.07 R40.1 ; 37.77,115.62 R53.2 ; 37.77,115.62 v1(38.4,114.99) 38.15,114.74 37.9,114.74 37.77,114.61 ; 37.77,115.62 37.77,114.61 ; 128.78,119.63 129.03,119.38 129.03,118.87 128.78,118.61 ; 128.78,119.63 R48.2 ; 128.78,119.63 128.78,118.61 ; 41.96,101.83 41.78,102 41.78,102.08 ; 41.96,101.83 v1(42.72,101.07) RN1.1 RN1.2 RN1.3 RN1.4 RN2.1 ; 41.96,101.83 41.96,102.08 41.78,102.08 ; 86.23,115.37 R35.1 ; 86.23,115.37 86.49,115.62 86.49,116.39 ; R35.1 85.58,115.37 85.55,115.41 v1(79.45,115.41) ; R35.1 85.72,110.6 R4.1 ; R35.1 85.72,115.62 86.49,116.39 ; 49.7,99.02 49.7,94.24 ; 49.7,99.02 49.21,99.02 ; 49.7,99.02 49.7,99.03 ; 49.7,99.02 49.97,99.02 RN2.2 ; 49.7,94.24 49.7,91.41 v1(49.63,91.34) ; 49.7,94.24 49.21,94.73 49.21,99.02 ; 49.7,94.24 v1(50.73,93.2) ; R8.1 R39.1 ; R8.1 103,110.42 ; R8.1 103.07,110.42 103,110.42 ; R39.1 103,115.62 102.24,116.39 ; v1(103.24,93.9) 103.24,98.44 103,98.67 ; v1(68.51,42.4) 69.02,42.91 CN11.1 ; 44.43,110.13 44.35,110.21 43.84,110.21 43.59,110.47 43.33,110.47 43.21,110.58 ; 44.43,110.13 U17.24 ; 44.43,110.13 44.43,110.58 ; U2.24 118.62,107.69 118.87,107.69 121.03,109.85 ; U2.24 115.68,110.42 103,110.42 ; U2.24 120.68,109.85 121.03,109.85 ; 145.4,101.81 145.4,100.29 145.29,100.18 ; 145.4,101.81 146.92,101.81 v1(147.69,101.05) ; 145.4,101.81 145.29,101.81 ; 146.05,109.58 v1(146.3,109.32) ; 146.05,109.58 145.29,110.34 R9.2 ; 146.05,109.58 v1(146.05,108.05) ; 146.05,109.58 146.05,109.83 R9.2 ; 145.29,101.81 145.15,101.81 R11.2 ; 145.29,101.81 R11.2 ; 145.29,101.81 145.29,100.18 ; 144.53,126.35 144.53,124.62 R44.2 ; 144.53,126.35 144.53,126.66 R45.2 145.09,127.16 144.58,126.66 144.58,126.4 144.53,126.35 ; 144.53,126.35 v1(144.32,126.15) ; 127.03,109.5 127,109.47 125.63,109.47 ; 127.03,109.5 127.03,111.12 127.28,111.37 128.05,111.37 ; 127.03,109.5 v1(127.25,109.72) ; 127.03,109.5 127.03,109.09 ; R49.2 128.81,116.09 128.81,112.13 128.05,111.37 ; R49.2 128.48,117.34 ; R49.2 128.02,117.13 128.23,117.34 128.48,117.34 ; 85.55,110.42 R4.1 ; 85.55,110.42 85.71,110.42 ; 85.55,110.42 85.55,110.33 ; R4.1 85.71,110.42 ; R15.2 R16.2 ; R15.2 128.28,102.41 128.81,102.41 ; R15.2 127.63,102.25 128.14,102.76 128.4,102.76 128.65,103.01 128.65,104.03 ; v1(127.25,109.72) R13.2 127.03,109.09 ; v1(127.25,109.72) 127.25,109.98 127.11,110.12 127.11,111.1 127.36,111.36 128.38,111.36 129.14,110.59 129.32,110.59 ; 42.95,110.58 42.45,110.58 ; 42.95,110.58 43.08,110.72 43.21,110.58 ; 42.95,110.58 42.83,110.47 42.57,110.47 42.45,110.58 ; 42.95,110.58 43.21,110.58 ; 42.45,110.58 42.06,110.97 42.06,111.23 v1(41.81,111.48) ; 42.45,110.58 41.89,110.58 ; 121.03,109.85 124.34,109.85 ; 121.03,109.85 121.16,109.98 124.21,109.98 124.34,109.85 ; 50.48,78.73 50.23,78.73 49.72,78.22 49.72,77.71 49.63,77.62 ; 50.48,78.73 51.75,77.46 v1(52,77.46) ; 50.48,78.73 49.63,79.58 ; 128.81,102.41 128.81,103.93 ; 128.81,102.41 131.09,100.12 132.36,100.12 132.87,100.63 132.87,102.15 ; 49.75,114.63 50,114.38 50.02,114.1 ; 49.75,114.63 49.24,114.63 48.99,114.38 49.22,114.1 ; 49.75,114.63 49.98,114.63 ; 44.43,110.58 44.43,111.09 44.18,111.35 44.18,113.38 44.9,114.1 ; 44.43,110.58 43.21,110.58 ; 103,110.42 85.71,110.42 ; 103,110.42 103,110.42 ; v1(87.25,123.49) 86.84,123.9 R37.1 86.49,124.67 86.49,126.44 86.23,126.7 85.72,126.7 ; 86.49,119.43 86.49,119.63 R36.1 ; 86.49,119.43 85.72,120.2 R36.1 ; 86.49,119.43 86.49,116.39 ; 45.7,114.1 45.68,114.38 45.43,114.63 ; 45.7,114.1 44.9,114.1 ; 45.7,114.1 46.5,114.1 ; 128.05,111.37 128.55,111.37 129.32,110.61 129.32,110.59 ; 132.87,102.15 132.87,104.18 132.11,104.95 131.35,104.95 129.32,106.98 129.32,110.59 ; 132.87,102.15 139.22,102.15 ; 85.71,110.42 85.71,110.33 85.63,110.25 ; v1(37.02,72.88) 36.76,72.88 36.76,72.84 37.53,72.84 38.03,72.33 ; v1(127.11,105.55) R14.2 127.89,104.79 ; v1(95.96,109.31) 90.88,109.31 90.12,110.07 85.8,110.07 85.63,110.25 ; 124.34,109.85 125.25,109.85 125.63,109.47 ; 124.34,109.85 124.71,109.47 125.63,109.47 ; 127.89,104.79 127.86,104.82 ; 127.89,104.79 128.65,104.03 ; 37.83,110.58 R17.2 ; 37.83,110.58 37.83,108.57 R18.2 37.53,108.5 36.63,109.41 36.37,109.41 36.12,109.66 v1(35.86,109.41) ; 37.83,110.58 41.89,110.58 ; R17.2 37.76,114.26 R52.2 37.77,114.61 ; R17.2 38,110.67 v1(38.51,110.67) ; 85.63,110.25 84.95,109.56 ; 85.63,110.25 85.55,110.33 ; 45.43,114.63 45.97,114.63 46.5,114.1 ; 45.43,114.63 44.9,114.63 ; 102.73,103.91 R6.1 101.98,102.63 101.98,99.69 103,98.67 ; 102.73,103.91 102.24,104.41 102.24,104.42 ; 102.73,103.91 102.98,104.17 102.73,104.42 102.24,104.42 ; 50.82,114.1 50.02,114.1 ; 50.82,114.1 51.62,114.1 ; 50.82,114.1 50.8,114.38 50.54,114.63 ; 50.02,114.1 49.22,114.1 ; 75.62,42.91 CN11.1 ; 75.62,42.91 v1(78.34,45.64) ; 75.62,42.91 CN12.1 81.79,42.91 v1(85.09,46.21) ; CN11.1 65.72,50.28 v1(65.21,50.28) ; 49.63,79.58 49.63,77.62 ; 49.63,79.58 49.46,79.74 v1(49.46,80) ; 49.63,79.58 v1(49.63,89.06) ; 49.63,77.62 U36.2 49.63,76.57 48.36,75.3 v1(47.34,75.3) ; 102.95,123.86 R41.1 102.24,124.67 102.24,126.66 R50.1 ; 102.95,123.86 102.45,123.86 v1(102.19,123.61) ; 103,110.42 102.24,109.65 102.24,107.88 R7.1 ; R42.2 146.05,121.07 146.05,123.1 R44.2 ; R42.2 144.53,119.54 144.53,116.01 145.22,115.31 ; R42.2 144.44,120.31 142.24,118.1 ; 51.05,114.63 51.73,114.63 ; 51.05,114.63 51.31,114.38 51.62,114.1 ; 51.05,114.63 50.54,114.63 ; 51.73,114.63 51.73,114.22 51.62,114.1 ; 51.73,114.63 51.73,114.73 59.61,122.6 60.74,122.6 61.5,121.84 61.5,109.65 ; 51.73,114.63 54.61,114.63 v1(54.86,114.89) ; R7.1 102.24,106.35 102.24,104.42 ; R7.1 102.73,106.86 v1(100.95,106.86) ; 125.63,109.47 126.01,109.09 127.03,109.09 ; 127.25,122.93 127.25,121.91 128.02,121.15 R48.2 ; 127.25,122.93 127.25,123.14 R47.2 ; 127.25,122.93 125.91,124.27 ; U39.16 104.45,33.57 103.38,34.65 103.38,35.04 CN10.1 ; U39.16 105.1,33.57 106.11,32.56 v1(106.62,32.56) 111.7,27.48 111.7,24.43 113.17,22.96 U5.1 ; U39.16 104.71,30.66 U5.1 ; v1(109.33,57.58) 109.59,57.58 110.35,56.81 111.11,57.58 111.87,57.58 112.12,57.83 ; 49.7,99.03 RN2.2 ; 49.7,99.03 RN2.1 ; RN2.2 RN2.3 RN2.4 ; 128.48,117.34 128.52,117.34 ; 128.48,117.34 128.52,117.39 ; RN2.1 49.21,99.02 ; R44.2 v1(144.07,123.86) ; 102.24,116.39 101.98,116.64 101.98,119.38 R40.1 ; 103,98.67 85.87,98.67 ; 84.95,109.56 84.87,109.64 ; 44.9,114.63 45.01,114.74 44.75,114.99 44.75,117.79 v1(44.25,118.3) ; 44.9,114.63 44.9,114.1 ; R10.2 145.29,107.29 v1(146.05,108.05) ; R10.2 146.05,107.85 v1(146.05,108.05) ; R10.2 145.18,106.98 142.78,106.98 140.75,104.95 139.98,104.95 139.22,104.18 139.22,102.15 ; v1(49.83,118.3) 49.58,118.04 49.58,117.53 49.33,117.28 49.33,115.5 49.22,115.39 49.98,114.63 ; 125.91,124.27 127.65,124.27 R47.2 ; 125.91,124.27 U16.24 v1(118.59,124.78) ; 128.52,117.39 128.52,118.1 128.78,118.36 ; 128.52,117.39 128.52,117.34 ; 128.52,117.39 128.78,117.64 128.78,118.36 ; 41.89,110.58 41.89,107.54 40.62,106.27 40.62,103.58 R51.2 41.78,102.08 ; v1(130.56,115.56) 131.06,116.07 139.19,116.07 139.95,116.84 140.97,116.84 142.24,118.1 ; 46.5,114.1 49.22,114.1 ; R36.1 84.46,121.66 84.46,124.92 84.96,125.43 84.96,126.44 ; R9.2 R43.2 145.22,115.31 ; R9.2 129.32,110.59 ; v1(84.74,103.81) 85.25,103.3 85.5,103.3 R2.1 ; 61.5,109.65 I2C1-A0.1 I2C1-A1.1 I2C1-A2.1 73.61,110.33 84.18,110.33 84.87,109.64 ; 61.5,109.65 I2C1-PWR.1 ; U5.1 v1(119.27,22.19) U6.1 U42.1 ; R48.2 127.46,120.39 v1(127.23,120.62) ; v1(59.37,40.12) 58.61,39.36 56.95,39.36 3.3V.4 3.3V.3 3.3V.2 3.3V.1 ; 85.87,98.67 86.47,99.27 86.47,102.52 R2.1 ; 85.87,98.67 R1.1 85.5,98.72 v1(84.74,98.72) ; 84.87,109.64 v1(84.53,109.31) ; 84.87,109.64 85.55,110.33 ; 102.24,104.42 v1(102.22,104.42) ; 128.65,104.03 128.78,103.9 ; R47.2 128.78,124.67 128.78,126.66 R46.2 128.17,127.32 v1(128.68,126.81) ; v1(109.6,126.15) 108.33,126.15 107.82,126.66 103.76,126.66 R50.1 ; 38.03,72.33 38.45,72.76 39.98,72.76 v1(40.23,73.02) ; 38.03,72.33 38,72.31 U35.2 38.03,71.82 38.03,72.33 38.03,72.33 ; 142.24,118.1 145.03,115.31 145.22,115.31 ; 112.12,57.83 U18.28 112.24,57.83 112.12,57.83 ; 112.12,57.83 v1(111.87,57.83) ; v1(78.61,126.44) 78.87,126.7 84.71,126.7 84.96,126.44 ; 49.98,114.63 50.54,114.63 ; 84.96,126.44 85.22,126.7 85.72,126.7 ; 79.66,105.33 79.15,105.33 78.9,105.58 78.9,106.09 v1(78.39,106.6) ; 79.66,105.33 v1(79.66,104.31) ; v1(102.47,87.04) 102.47,84.25 102.98,83.74 v1(102.98,67.23) ; v1(53.27,79.49) 51.5,81.27 v1(51.5,89.65) ; 139.22,102.15 139.48,102.41 144.95,102.41 R11.2 ; 128.52,117.34 v1(128.78,117.34) ; 85.72,126.7 R38.1 89.53,127.42 v1(90.81,126.15) 92.07,127.42 R50.1 ; 128.78,118.36 128.78,118.61 ; 145.29,100.18 R12.2
  Inner2 w0.254: v1(146.3,109.32) 146.05,109.07 v1(146.05,108.05) ; v1(49.46,80) 42.86,73.39 41.59,73.39 41.34,73.65 40.83,73.65 ; v1(95.96,109.31) 96.98,108.29 96.98,107.79 97.23,107.53 100.03,107.53 100.7,106.86 v1(100.95,106.86) 102.22,105.59 v1(102.22,104.42) ; v1(116.71,126.15) 116.46,125.89 109.85,125.89 v1(109.6,126.15) ; 71.79,109.65 I2C1-A1.1 I2C1-A0.1 66.58,114.54 66.8,114.76 66.8,115.01 66.29,115.52 v1(60.96,115.52) ; 71.79,109.65 I2C1-A2.1 73.86,110.58 79.45,110.58 ; 71.79,109.65 71.79,106.6 72.55,105.84 77.38,105.84 78.14,106.6 v1(78.39,106.6) ; 40.83,73.65 27.62,86.85 23.3,86.85 19.49,83.04 19.49,82.54 18.73,81.77 17.08,81.77 16.57,82.28 ; 40.83,73.65 40.07,72.88 v1(37.02,72.88) ; PWM-A3.1 98.3,55.35 98.3,54.6 ; PWM-A3.1 97.03,56.37 97.03,55.61 96.01,54.6 ; PWM-A3.1 94.05,56.56 ; PWM-A3.1 PWM-A4.1 ; v1(85.09,46.21) 96.77,46.21 97.28,45.71 ; 79.45,110.58 83.26,110.58 v1(84.53,109.31) ; 79.45,110.58 v1(79.45,115.41) ; 98.3,54.6 98.35,54.6 PWM-A4.1 ; 98.3,54.6 98.3,52.31 ; v1(85.2,55.55) 80.37,50.72 80.37,47.67 v1(78.34,45.64) ; 97.28,45.71 97.28,45.2 v1(97.54,44.94) 100.33,44.94 ; 97.28,45.71 97.28,50.02 98.3,51.04 98.3,52.31 ; PWM-A4.1 PWM-A5.1 104.5,57.58 ; v1(65.21,50.28) 64.45,49.52 64.45,44.94 63.69,44.18 v1(63.69,30.72) ; v1(130.56,115.56) v1(128.78,117.34) 128.02,116.58 128.02,110.48 v1(127.25,109.72) 127.25,105.91 127,105.66 v1(127.11,105.55) ; 104.5,57.58 v1(109.33,57.58) 111.62,57.58 v1(111.87,57.83) ; 104.5,57.58 102.98,59.1 v1(102.98,67.23) ; 16.57,82.28 16.82,82.54 16.82,86.85 11.49,92.19 11.49,92.44 U44.15 ; 16.57,82.28 U48.4 ; v1(41.81,111.48) 41,110.67 v1(38.51,110.67) 37.64,110.67 ; 98.3,52.31 98.55,52.06 98.55,46.72 100.33,44.94 ; 98.3,52.31 97.79,52.82 96.52,52.82 95.76,53.58 95.76,54.34 96.01,54.6 ; 100.33,44.94 100.33,42.4 99.82,41.9 97.79,41.9 96.77,42.91 CN10.1 ; 100.33,44.94 114.23,44.94 118.84,40.34 ; 118.84,40.34 CN63.1 ; 118.84,40.34 118.87,40.37 118.99,40.25 CN63.1 ; 118.84,40.34 118.62,40.12 106.93,40.12 106.17,39.36 103.63,39.36 v1(103.38,39.1) ; CN63.1 CN62.1 CN61.1 CN60.1 CN59.1 147.48,40.18 ; 3.3V.1 3.3V.2 3.3V.3 3.3V.4 27.99,10.4 42.1,10.4 v1(55.05,23.35) ; v1(57.91,113.62) 60.17,111.36 I2C1-PWR.1 ; 147.48,40.18 CN58.1 CN57.1 CN56.1 ; 147.48,40.18 v1(147.73,39.92) ; 37.64,110.67 37.64,114.23 v1(38.4,114.99) ; 37.64,110.67 37.13,110.67 v1(35.86,109.41) ; 94.05,56.56 PWM-A2.1 PWM-A1.1 PWM-A0.1 v1(87.49,57.83) ; 94.05,56.56 96.01,54.6 ; v1(87.25,123.49) 88.01,124.25 88.77,124.25 88.77,124.37 90.55,124.37 90.55,125.89 v1(90.81,126.15) ; v1(84.74,103.81) 82.46,103.81 81.44,104.82 80.17,104.82 v1(79.66,104.31) 79.66,103.3 80.68,102.28 81.44,102.28 84.74,98.98 v1(84.74,98.72) ; v1(118.59,124.78) 119.86,123.51 121.13,123.51 121.89,122.75 121.64,122.49 122.4,121.73 124.94,121.73 126.21,120.46 127.23,120.46 127.74,119.95 127.74,120.11 v1(127.23,120.62) ; v1(49.63,91.34) v1(49.63,89.06) ; U42.1 U6.1 v1(119.27,22.19) ; v1(101.94,122.34) 102.19,122.08 v1(102.19,121.07) ; v1(102.47,87.04) 102.98,87.55 102.98,88.56 102.47,89.07 102.47,90.09 103.24,90.85 v1(103.24,93.9) ; v1(50.73,93.2) 51.5,92.44 51.5,91.68 51.24,91.43 51.24,89.9 v1(51.5,89.65) ; v1(61.4,54.09) 57.08,54.09 54.29,56.88 54.29,57.39 54.04,57.64 54.04,72.88 52,74.92 v1(52,77.46) 52,78.22 v1(53.27,79.49)
  Bottom Layer w0.254: v1(40.23,73.02) 45.06,73.02 v1(47.34,75.3) ; v1(87.25,123.49) 85.72,123.49 85.63,123.4 85.38,123.65 83.09,123.65 81.31,121.87 75.22,121.87 73.44,120.09 72.42,120.09 71.66,120.86 71.66,121.11 70.14,122.63 69.37,122.63 68.61,123.4 68.61,126.47 ; v1(87.49,57.83) v1(85.2,55.55) ; v1(49.83,118.3) v1(44.25,118.3) 42.47,118.3 ; 102.62,37.83 106.87,33.57 106.87,33.07 106.62,32.81 v1(106.62,32.56) ; 102.62,37.83 103.38,38.59 v1(103.38,39.1) ; 102.62,37.83 98.55,41.9 97.03,41.9 96.77,42.15 96.27,42.15 CN10.1 v1(97.54,44.94) ; v1(78.61,126.44) 72.95,126.44 I2C2-A2.1 ; 102.7,123.1 v1(102.19,123.61) ; 102.7,123.1 v1(101.94,122.34) ; 102.7,123.1 104.22,123.1 104.48,122.85 104.73,122.85 105.24,123.35 105.24,123.86 104.22,124.88 104.01,124.88 102.49,126.4 99.19,126.4 98.93,126.66 97.16,126.66 96.39,125.89 91.06,125.89 v1(90.81,126.15) ; 68.61,126.54 69.63,126.54 I2C2-A1.1 ; 68.61,126.54 68.61,126.47 ; 68.61,126.54 I2C2-A0.1 ; v1(63.69,30.72) 56.32,23.35 v1(55.05,23.35) ; I2C2-A2.1 72.88,126.47 I2C2-A1.1 ; I2C2-A2.1 69.8,126.43 I2C2-A1.1 ; v1(35.86,109.41) 37.13,108.14 37.13,106.65 v1(42.72,101.07) ; 42.47,118.3 42.47,119.06 42.21,119.31 42.21,125.83 I2CX-A0.1 I2CX-A1.1 I2CX-A2.1 52.96,126.54 I2C2-PWR.1 I2C2-A0.1 ; 42.47,118.3 41.71,118.3 40.94,119.06 40.18,119.06 39.67,118.55 39.67,118.04 38.66,117.03 ; I2C2-A1.1 68.61,126.47 ; 38.66,117.03 32.05,123.63 27.48,123.63 26.72,122.87 26.21,123.38 U43.3 ; 38.66,117.03 38.66,115.25 v1(38.4,114.99) ; v1(78.34,45.64) 78.85,45.13 79.1,45.13 80.32,43.91 CN12.1 ; v1(144.32,126.15) 144.58,125.89 144.58,124.37 v1(144.07,123.86) 141.02,123.86 140.77,124.12 131.12,124.12 130.45,124.78 130.45,125.03 v1(128.68,126.81) 127.23,126.81 126.72,127.32 121.13,127.32 v1(118.59,124.78) 118.49,124.88 117.98,124.88 v1(116.71,126.15) ; 68.61,126.47 66.64,126.47 I2C2-A0.1 ; v1(147.69,101.05) 148.7,100.04 149.46,100.04 150.88,101.45 150.88,106.02 149.61,107.29 146.81,107.29 v1(146.05,108.05) ; v1(68.51,42.4) 68.01,41.9 66.48,41.9 64.7,40.12 v1(59.37,40.12) ; v1(54.86,114.89) 56.13,113.62 v1(57.91,113.62) 58.67,114.38 58.67,115.14 59.18,115.65 60.7,115.65 60.7,115.52 v1(60.96,115.52) ; CN56.1 CN57.1 CN58.1 153.07,39.92 v1(147.73,39.92) ; v1(65.21,50.28) v1(61.4,54.09)
3.3VEXT: length 544.1
  Top Layer w0.5: 64.58,81.94 65.08,82.44 68.33,82.44 69.83,80.94 71.33,82.44 75.21,82.44 76.71,80.94 78.21,82.44 79.21,82.44 v1(79.71,82.94) ; 64.58,81.94 63.33,80.69 62.83,80.69 ; 64.58,81.94 64.08,81.94 60.17,85.86 I2C1-PWR.3 58.67,106.07 58.67,120 I2C2-PWR.3 ; 149.4,81.44 149.77,81.07 U32.1 ; 149.4,81.44 152.9,81.44 153.9,82.44 155.4,82.44 ; 149.4,81.44 148.4,82.44 v1(147.9,82.44) ; 155.4,82.44 156.77,81.07 159.07,81.07 ; 155.4,82.44 v1(156.4,83.44) ; 111.09,80.94 110.9,81.14 110.9,82.44 v1(110.4,82.94) ; 117.97,80.94 117.9,81.01 117.9,82.94 v1(117.4,83.44) ; v1(91.03,89.44) 91.03,88.44 90.53,87.94 90.53,83.44 91.53,82.44 v1(93.53,82.44) 95.03,80.94 97.38,80.94 ; 62.83,80.69 62.83,80.19 61.33,78.69 61.33,66.69 62.83,65.19 62.83,52.69 60.83,50.69 v1(60.83,26.69) C1.1 63.28,22.25 3.3VEXT.2 ; 62.83,80.69 62.85,80.94
  Inner2 w0.5: 131.76,80.94 133.26,82.44 134.76,82.44 136.26,80.94 138.26,80.94 ; 131.76,80.94 130.26,82.44 126.29,82.44 124.79,80.94 ; 131.76,80.94 131.76,84.94 130.76,85.94 131.76,86.94 131.76,89.44 132.26,89.94 ; 142.64,82.44 143.9,82.44 145.4,80.94 ; 142.64,82.44 141.64,83.44 ; 142.64,82.44 144.14,80.94 145.4,80.94 ; 142.64,82.44 140.64,82.44 ; 112.59,82.44 113.4,82.44 ; 112.59,82.44 111.09,80.94 109.59,82.44 106.9,82.44 ; 112.59,82.44 110.9,82.44 v1(110.4,82.94) ; 113.4,82.44 113.9,82.94 v1(113.9,83.44) ; 113.4,82.44 114.09,82.44 115.59,80.94 117.59,80.94 ; 152.03,81.07 U32.1 ; 152.03,81.07 153.53,82.57 157.57,82.57 159.07,81.07 160.57,82.57 164.44,82.57 U34.1 ; 152.03,81.07 150.03,81.07 148.53,82.57 147.03,82.57 145.4,80.94 ; 90.53,80.94 92.03,82.44 92.53,82.44 ; 90.53,80.94 91.03,80.94 92.53,82.44 ; 90.53,80.94 88.16,80.94 86.66,82.44 85.66,82.44 84.16,80.94 81.35,80.94 79.85,82.44 78.85,82.44 77.35,80.94 74.35,80.94 72.85,82.44 71.35,82.44 70.85,81.94 69.85,81.94 ; 90.53,80.94 88.53,82.94 v1(79.71,82.94) ; 69.83,80.94 69.85,81.44 69.85,81.94 ; 145.4,80.94 145.9,80.94 147.4,82.44 v1(147.9,82.44) ; 104.28,81.19 104.72,80.76 106.4,82.44 ; 104.28,81.19 104.22,81.13 ; 104.28,81.19 105.53,82.44 106.4,82.44 ; 104.28,81.19 104.22,81.26 ; 132.26,89.94 133.26,88.94 140.14,88.94 141.64,87.44 141.64,83.44 ; 132.26,89.94 132.26,90.44 131.76,90.94 131.76,91.44 129.76,93.44 123.4,93.44 117.9,87.94 117.9,83.94 v1(117.4,83.44) ; 106.9,82.44 v1(107.4,82.94) ; 106.9,82.44 106.4,82.44 ; 124.79,80.94 124.4,80.94 123.9,81.44 122.9,81.44 121.9,82.44 ; 124.79,80.94 123.29,82.44 121.9,82.44 ; 104.22,81.26 104.22,81.13 ; 104.22,81.26 v1(104.22,84.76) ; 104.22,81.13 104.22,80.94 104.03,80.94 ; 104.22,81.13 104.03,80.94 ; 141.64,83.44 140.64,82.44 ; 140.64,82.44 139.14,80.94 138.26,80.94 ; 140.64,82.44 139.76,82.44 138.26,80.94 ; 97.03,80.94 98.53,82.44 100.53,82.44 102.03,80.94 104.03,80.94 ; 97.03,80.94 95.03,80.94 v1(93.53,82.44) 92.53,82.44 ; 97.03,80.94 97.38,80.94 ; 69.85,81.94 69.85,83.44 64.35,88.94 63.85,88.94 ; 121.9,82.44 119.09,82.44 117.59,80.94 ; 121.9,82.44 121.4,82.94 v1(121.4,83.44) ; v1(60.83,26.69) 62.83,28.69 62.83,44.19 63.83,45.19 63.83,61.19 62.85,62.18 62.85,69.18 61.35,70.68 61.35,78.68 62.85,80.18 62.85,87.94 63.85,88.94 ; 63.85,88.94 61.85,90.94 61.85,91.94 60.17,93.63 I2C1-PWR.3 60.17,105.07 61.67,106.57 61.67,111.07 60.17,112.57 60.17,121.41 I2C2-PWR.3 ; 117.59,80.94 117.97,80.94
  Bottom Layer w0.5: v1(91.03,89.44) 99.53,89.44 101.53,87.44 101.53,86.94 103.53,84.94 104.03,84.94 v1(104.22,84.76) ; 116.4,83.44 116.4,86.44 118.4,88.44 118.9,88.44 119.4,88.94 121.4,86.94 v1(121.4,83.44) ; 116.4,83.44 v1(117.4,83.44) ; 116.4,83.44 v1(113.9,83.44) ; U34.1 165.94,83.57 160.57,88.94 160.07,88.44 159.57,88.44 156.9,85.78 156.9,83.94 v1(156.4,83.44) ; 83.66,80.94 81.66,82.94 v1(79.71,82.94) ; v1(107.4,82.94) v1(110.4,82.94)
5VEXT: length 1024.2
  Top Layer w0.343: 42.91,72.68 42.73,72.5 ; 42.91,72.68 45.48,75.25 ; 42.91,72.68 40.13,75.45 39.88,75.45 39.38,74.95 ; 42.91,72.68 v1(43.63,71.95) ; 42.73,72.5 41.9,71.67 U35.8 ; 42.73,72.5 41.83,72.5 39.38,74.95 ; U35.8 41.9,68.43 SONAR2.1 ; U35.8 42.13,71.45 v1(42.63,70.95) ; 49.63,72.6 U36.15 49.63,71.1 ; 49.63,72.6 49.63,74.1 v1(54.13,78.6) ; 49.63,72.6 47.63,74.6 46.63,74.6 45.73,75.5 ; v1(47.28,73.45) 45.48,75.25 ; 45.48,75.25 44.78,75.95 44.78,76.38 U36.8 45.73,75.5 ; 45.48,75.25 45.73,75.5 ; 49.63,71.1 49.78,70.95 49.78,70.45 v1(50.28,69.95) ; 49.63,71.1 49.63,63.48 v1(49.39,63.24) ; 39.38,74.95 38,76.33 ; 39.38,74.95 38.88,74.95 37.88,75.95 38,75.95 38,76.33 ; 38,76.33 U35.15 38,81.33 37,82.33 37,88.42 SONAR0.1
  Top Layer w0.5: SONAR2.1 32.98,65.52 HOSTUSB.1 18.05,48.85 v1(24.89,55.69) ; v1(69.33,73.91) 67.33,75.91 U20.3 ; 66.39,34.19 75.89,24.69 C2.1 ; 66.39,34.19 62.89,37.69 ; 66.39,34.19 66.89,34.19 C2.1 ; SONAR0.1 SONAR1.1 ; 78.39,22.69 78.39,20.69 78.84,20.25 ; 78.39,22.69 78.84,22.25 78.84,20.25 ; 78.39,22.69 C2.1 ; 62.89,37.69 v1(61.89,38.69) ; 62.89,37.69 v1(62.89,45.69) ; 78.84,13.25 86.34,13.25 v1(86.84,13.75) ; 78.84,13.25 78.84,20.25 ; 78.84,13.25 5VEXT.2 ; 78.84,20.25 v1(78.89,20.19) ; v1(145.9,77.17) 145.9,78.17 147.4,79.67 151.09,79.67 U32.3 ; v1(93.66,74.41) 94.66,75.41 94.66,75.69 97.16,78.19 ; v1(97.66,77.19) 97.66,77.69 97.16,78.19 ; v1(27.49,117.91) 27.49,126.91 26.99,127.41 26.99,127.74 U37.VIN ; U31.3 145.4,77.91 143.9,76.41 143.9,74.91 141.4,72.41 v1(140.4,72.41) ; 97.16,78.19 U24.3 ; v1(137.14,73.91) 136.64,74.41 v1(136.64,77.91) v1(136.64,79.91)
  Inner2 w0.343: 50.28,70.95 50.63,70.95 ; 50.28,70.95 49.63,70.95 ; 50.28,70.95 v1(50.28,69.95) ; 50.28,79.12 50.28,76.95 51.28,75.95 49.78,74.45 49.28,74.45 48.28,73.45 48.13,73.45 ; 50.28,79.12 50.28,80.12 49.28,81.12 49.28,85.12 47.78,86.62 46.28,86.62 45.78,87.12 45.78,88.12 46.28,88.62 46.28,89.62 45.78,90.12 39.28,90.12 SONAR0.1 ; 50.28,79.12 51.28,78.12 51.57,78.41 51.57,78.91 53.07,80.41 53.57,80.41 54.07,79.91 v1(54.07,79.41) ; 49.63,70.95 48.63,71.95 48.63,72.95 48.13,73.45 ; 49.63,70.95 49.89,70.69 49.89,58.69 47.39,56.19 ; 48.13,73.45 v1(47.28,73.45) 46.63,73.45 46.13,72.95 44.63,72.95 v1(43.63,71.95) v1(42.63,70.95) ; v1(62.07,71.41) 62.57,71.91 62.57,73.91 64.07,75.41 64.07,76.41 63.07,77.41 63.07,78.19 U19.3 62.65,78.6 v1(54.13,78.6)
  Inner2 w0.5: 74.71,76.41 74.71,75.91 75.33,75.28 ; 74.71,76.41 72.71,74.41 69.33,74.41 68.33,75.41 68.33,76.91 U20.3 65.64,82.6 62.13,82.6 61.13,81.6 61.13,78.6 ; 74.71,76.41 U21.3 76.71,77.78 75.33,76.41 75.33,75.28 ; 82.33,75.28 83.21,74.41 86.53,74.41 ; 82.33,75.28 82.16,75.45 ; 82.33,75.28 82.33,76.41 83.66,77.73 83.66,78.36 ; 82.33,75.28 82.33,74.91 ; 102.16,76.35 101.16,75.35 101.16,75.19 ; 102.16,76.35 102.16,76.19 101.16,75.19 ; 102.16,76.35 102.16,76.85 103.66,78.35 U25.3 104.22,78.09 102.03,75.91 ; 82.16,74.73 82.16,74.41 84.16,72.41 ; 82.16,74.73 79.83,72.41 77.83,74.41 ; 82.16,74.73 82.33,74.91 ; 82.16,74.73 82.16,75.45 ; SONAR1.1 47.07,90.41 46.28,89.62 ; 98.94,73.91 99.16,73.69 99.66,73.69 99.88,73.91 ; 98.94,73.91 97.53,73.91 95.53,75.91 95.53,76.41 ; 98.94,73.91 99.88,73.91 ; 98.94,73.91 98.16,74.69 98.66,75.19 98.66,76.69 98.16,77.19 v1(97.66,77.19) ; 77.83,74.41 79.71,74.41 81.71,76.41 ; 77.83,74.41 76.21,74.41 ; 90.16,74.41 93.53,74.41 ; 90.16,74.41 90.03,74.41 88.53,75.91 88.53,76.41 ; 90.16,74.41 88.16,72.41 84.53,72.41 ; 93.53,74.41 v1(93.66,74.41) ; 93.53,74.41 95.53,76.41 ; 44.39,62.19 42.39,62.19 ; 44.39,62.19 45.89,60.69 45.89,57.19 46.39,56.69 46.89,56.69 59.39,44.19 59.39,41.19 v1(61.89,38.69) ; 44.39,62.19 44.39,63.54 46.24,65.39 SONAR3.1 v1(49.39,63.24) ; 42.39,62.19 v1(42.31,62.19) ; 42.39,62.19 40.39,60.19 40.39,57.69 36.39,53.69 v1(33.89,53.69) ; 75.33,75.28 76.21,74.41 ; 75.33,75.28 75.33,74.41 ; 76.21,74.41 75.33,74.41 ; 111.09,73.91 110.59,74.41 ; 111.09,73.91 111.59,74.41 ; 111.09,73.91 111.03,73.85 111.03,73.35 109.53,71.85 108.03,73.35 105.66,73.35 105.16,72.85 104.16,73.85 103.66,73.85 102.66,72.85 102.16,73.35 101.66,73.35 101.16,73.85 101.16,75.03 ; 110.59,74.41 111.59,74.41 ; 110.59,74.41 110.53,74.41 109.03,75.91 ; 110.59,74.41 109.59,75.41 109.59,76.41 111.09,77.91 111.09,77.96 ; 84.53,72.41 84.16,72.41 ; 84.53,72.41 86.53,74.41 ; 145.4,78.17 U31.3 ; 145.4,78.17 141.64,74.41 140.14,74.41 139.14,73.41 137.64,73.41 v1(137.14,73.91) ; 145.4,78.17 145.9,77.67 v1(145.9,77.17) ; 83.66,78.36 U22.3 82.16,76.91 82.16,76.86 ; 83.66,78.36 82.16,76.86 ; 82.33,74.91 83.33,73.91 83.33,73.41 ; 75.33,74.41 73.83,72.91 73.33,72.91 72.83,72.41 v1(70.83,72.41) ; U40.1 U41.1 U4.1 U8.1 90.29,9.8 86.84,13.25 v1(86.84,13.75) ; 101.16,75.19 101.16,75.03 ; 101.16,75.19 99.88,73.91 ; 101.16,75.03 100.03,73.91 99.88,73.91 ; 101.16,75.03 102.03,75.91 ; 117.97,78.28 117.97,77.78 116.59,76.41 116.59,75.41 114.59,73.41 113.59,74.41 ; 117.97,78.28 117.97,78.41 ; 117.97,78.28 117.9,78.34 ; 109.03,75.91 107.03,73.91 104.03,73.91 102.03,75.91 ; 109.03,75.91 111.09,77.96 ; 86.53,74.41 88.53,76.41 ; 84.16,72.41 84.25,72.32 ; v1(35.49,94.91) 35.49,102.91 37.49,104.91 v1(37.49,105.41) ; U30.3 137.14,79.91 v1(136.64,79.91) ; 88.53,76.41 U23.3 ; 82.16,75.45 81.71,75.91 81.71,76.41 ; 82.16,75.45 82.16,76.86 ; 117.9,78.34 113.97,74.41 113.59,74.41 ; 117.9,78.34 v1(116.97,79.28) ; 117.9,78.34 117.97,78.41 ; 113.59,74.41 111.59,74.41 ; 82.16,76.86 81.71,76.41 ; 111.09,77.96 U26.3 ; 117.97,78.41 v1(116.47,79.91) ; v1(64.83,73.41) 64.57,73.41 63.57,74.41 63.07,74.41 ; 95.53,76.41 97.38,78.25 U24.3 ; v1(140.4,72.41) 138.14,72.41 137.64,71.91 136.64,71.91 136.14,72.41 136.14,72.91 136.64,73.41 v1(136.64,77.91) 136.64,78.41 136.47,78.57 v1(136.47,81.78) ; SONAR0.1 v1(37.49,91.91)
  Bottom Layer w0.343: v1(47.28,73.45) 48.28,73.45 48.78,72.95 48.78,71.45 v1(50.28,69.95) ; v1(54.07,79.41) v1(62.07,71.41)
  Bottom Layer w0.5: 150.97,82.13 151.51,82.67 155.08,82.67 ; 150.97,82.13 148.51,79.67 147.4,79.67 145.9,78.17 v1(145.9,77.17) ; 150.97,82.13 150.97,79.78 151.97,78.78 U32.3 ; 150.97,82.13 150.97,82.28 151.47,82.78 154.47,82.78 ; 122.53,80.84 123.47,81.78 123.47,81.91 ; 122.53,80.84 122.47,80.91 ; 122.53,80.84 122.47,80.78 ; 122.53,80.84 124.79,78.58 124.79,78.45 ; 130.47,82.11 130.47,81.78 129.47,80.78 ; 130.47,82.11 130.64,82.28 ; 130.47,82.11 129.3,80.94 ; 130.47,82.11 130.47,82.28 130.64,82.28 ; 123.47,81.91 123.84,82.28 ; 123.47,81.91 123.47,82.28 123.84,82.28 ; 123.47,81.91 122.47,80.91 ; v1(136.64,77.91) 137.14,78.41 U30.3 ; 122.47,80.78 124.79,78.45 ; 122.47,80.78 120.97,82.28 116.97,82.28 116.47,81.78 ; 124.79,78.45 U28.3 ; v1(78.89,20.19) 78.89,13.19 ; 78.89,13.19 82.29,9.8 U8.1 U4.1 U41.1 U40.1 ; 78.89,13.19 5VEXT.2 ; 116.47,81.78 v1(116.47,79.91) 116.47,79.78 v1(116.97,79.28) ; 116.47,81.78 116.47,81.91 116.97,82.41 120.97,82.41 122.47,80.91 ; v1(27.49,117.91) 27.49,116.91 31.99,112.41 31.99,110.91 v1(37.49,105.41) ; 130.64,82.28 130.76,82.41 134.64,82.41 134.76,82.28 ; 130.64,82.28 134.76,82.28 ; v1(35.49,94.91) 35.49,93.91 v1(37.49,91.91) ; v1(62.89,45.69) 61.89,45.69 48.89,58.69 48.89,62.69 49.39,63.19 v1(49.39,63.24) ; 154.47,82.78 154.97,82.78 155.08,82.67 ; 154.47,82.78 154.97,83.28 154.97,84.78 155.97,85.78 155.47,86.28 155.47,88.78 157.47,90.78 157.47,91.78 157.97,91.78 158.47,92.28 158.47,93.28 157.97,93.78 144.47,93.78 137.47,86.78 137.47,82.78 v1(136.47,81.78) 135.47,81.78 134.97,82.28 134.76,82.28 ; v1(42.31,62.19) SONAR2.1 ; 155.08,82.67 157.4,80.35 ; 155.08,82.67 155.4,82.67 156.9,81.17 ; 157.4,80.35 157.4,80.67 156.9,81.17 ; 157.4,80.35 158.97,78.78 ; 157.4,80.35 157.4,80.2 158.97,78.63 ; 129.47,80.78 131.76,78.48 U29.3 129.26,80.91 ; 129.47,80.78 129.3,80.94 ; 123.84,82.28 127.89,82.28 ; 123.84,82.28 123.97,82.41 127.76,82.41 127.89,82.28 ; v1(70.83,72.41) v1(69.33,73.91) 68.83,73.91 68.33,73.41 v1(64.83,73.41) ; 129.3,80.94 127.97,82.28 127.89,82.28 ; 129.3,80.94 129.26,80.91 ; 134.76,82.28 136.64,80.41 v1(136.64,79.91) ; 156.9,81.17 156.9,81.67 157.9,82.67 161.81,82.67 U34.3 163.72,78.53 162.47,77.28 160.97,77.28 159.47,78.78 158.97,78.78 ; 127.89,82.28 129.26,80.91 ; 158.97,78.78 158.97,78.63 ; 158.97,78.63 159.07,78.53 ; v1(24.89,55.69) 26.89,53.69 v1(33.89,53.69)
GND: length 2125.8
  Top Layer w0.254: PWM-A0.3 PWM-A1.3 91.46,51.48 ; PWM-A0.3 85.68,51.48 ; PWM-A0.3 87.49,47.57 85.15,45.24 ; 126.87,37.64 CN62.2 CN63.2 118.61,38.02 109.08,38.02 108.82,38.27 108.82,39.03 109.08,39.29 111.11,39.29 111.62,39.8 111.62,41.32 110.35,42.59 ; 126.87,37.64 v1(126.87,37.13) ; 126.87,37.64 v1(130.18,37.64) CN61.2 CN60.2 CN59.2 v1(149,37.64) v1(149.76,37.64) ; 112.15,100.03 112.17,100.05 ; 112.15,100.03 112.19,100.03 112.19,99.52 112.44,99.27 112.44,99.02 ; 112.15,100.03 111.68,100.03 v1(111.17,100.54) ; 112.15,100.03 111.91,99.8 111.91,99.55 112.44,99.02 ; 112.17,100.05 112.17,100.03 ; 112.17,100.05 112.17,100.23 ; 155.86,93.17 157.38,93.17 ; 155.86,93.17 154.59,91.9 LED14.2 ; 155.86,93.17 154.84,93.17 LED14.2 ; 157.38,93.17 157.64,93.43 157.89,93.43 ; 157.38,93.17 158.15,93.17 ; v1(65.07,41.76) 71.56,41.76 73.09,40.23 ; 110.35,42.59 110.3,42.59 U39.8 ; 110.35,42.59 110.09,42.84 110.09,44.88 107.04,47.93 ; 51.56,92.23 53.09,92.23 v1(53.41,91.9) ; 51.56,92.23 SONAR1.2 45.97,86.64 45.97,85.75 ; 51.56,92.23 52.32,92.99 52.32,102.83 U17.12 51.97,103.96 51.97,104.34 50.7,105.61 50.44,105.61 v1(50.19,105.86) ; v1(104.19,93.94) 105.68,92.44 LED7.2 ; I2C1-A0.3 I2C1-A1.3 69.85,104.47 72.83,104.47 ; 114.28,56.43 114.28,57.46 U18.25 114.42,56.57 114.28,56.43 ; 114.28,56.43 v1(113.9,56.05) ; 114.28,56.43 v1(114.28,55.55) ; CN85.1 150.22,71.17 v1(148.96,69.9) ; 18.29,47.91 32.77,62.38 39.12,62.38 v1(42.42,65.69) 42.42,68.29 U36.9 45.48,71.91 v1(45.22,72.16) ; 18.29,47.91 14.22,47.91 13.97,48.16 13.97,52.7 HOSTUSB.5 13.91,45.68 14.1,45.49 18.42,45.49 ; 18.29,47.91 18.54,47.65 18.54,45.62 ; 100.63,93.17 99.36,91.9 LED6.2 ; 100.63,93.17 101.39,93.94 v1(102.16,93.94) ; 100.63,93.17 104.41,93.17 LED7.2 ; 100.63,93.17 99.87,93.17 LED6.2 ; H18.1 H18.3 ; H18.1 4.01,34.65 ; H18.1 4.01,34.65 4.01,34.65 ; H18.3 6.94,29.03 GND.1 ; H18.3 3.94,13.34 GND.1 ; 112.44,99.02 LED8.2 ; 76.39,92.67 77.09,92.67 LED3.2 ; 76.39,92.67 77.15,91.9 LED3.2 ; 76.39,92.67 72.83,92.67 ; ETHERNET.8 157.23,102.79 ; ETHERNET.8 158.91,100.92 158.91,94.44 157.89,93.43 ; ETHERNET.8 159.15,100.87 159.15,98.25 162.7,94.7 163.21,94.7 ; 157.23,102.79 153.92,106.09 149.21,106.09 148.95,106.34 143.11,106.34 v1(142.97,106.2) ; 157.23,102.79 157.23,103.3 166.12,112.19 167.74,112.19 169.77,114.22 ; SONAR0.2 41.15,85.75 45.97,85.75 ; 131.08,93.17 131.73,93.17 LED11.2 ; 131.08,93.17 132.35,91.9 LED11.2 ; 131.08,93.17 127.78,93.17 ; 18.54,45.11 18.54,43.59 ; 18.54,45.11 18.54,45.62 ; 18.54,45.11 18.67,44.98 18.67,43.71 18.54,43.59 ; 18.54,45.11 18.42,45.24 18.42,45.49 ; 18.54,43.59 16.89,41.94 ; 107.04,47.93 107.81,47.93 109.84,49.96 110.09,49.96 ; 107.04,47.93 PWM-A5.3 PWM-A4.3 PWM-A3.3 PWM-A2.3 91.46,51.48 ; 4.01,34.65 5.02,34.65 6.04,35.67 11.63,35.67 HOSTUSB.6 ; 4.01,34.65 7.31,37.95 HOSTUSB.6 ; 18.54,45.62 18.42,45.49 ; 18.54,45.62 25.78,52.86 28.83,52.86 v1(31.88,55.91) ; LED15.2 159.42,91.9 158.15,93.17 ; LED15.2 163.21,94.7 ; LED15.2 159.15,93.17 158.15,93.17 ; U35.9 42.26,77.33 42.48,77.11 ; U35.9 42.12,77.11 42.48,77.11 ; U35.9 v1(41.9,78.6) ; 85.15,45.24 85.15,44.98 88.71,41.43 93.03,41.43 94.04,40.41 CN10.2 ; 85.15,45.24 CN12.2 76.71,36.79 76.71,36.61 ; HOSTUSB.4 16.81,41.85 16.89,41.94 ; HOSTUSB.4 14.03,39.57 14.03,38.3 HOSTUSB.6 ; HOSTUSB.4 16.31,40.35 HOSTUSB.6 ; HOSTUSB.4 16.31,41.87 16.38,41.94 16.89,41.94 ; 66.58,121.52 65.06,123.05 v1(61.25,123.05) ; 66.58,121.52 I2C2-A0.3 ; 66.58,121.52 66.71,121.65 66.96,121.39 I2C2-A1.3 69.8,121.35 I2C2-A2.3 73.02,121.44 79.25,121.44 CN64.2 v1(83.35,122.96) ; 42.93,77.11 42.48,77.11 ; 42.93,77.11 42.42,77.62 42.42,81.69 45.97,85.24 45.97,85.75 ; 42.93,77.11 v1(43.18,77.11) ; 42.48,77.11 v1(42.51,77.08) ; 157.89,93.43 158.15,93.17 ; LED7.2 LED8.2 ; LED3.2 LED4.2 LED5.2 LED6.2 ; LED2.2 64.16,91.97 v1(64.16,95.02) ; LED2.2 70.83,91.9 ; LED2.2 63.99,91.65 v1(61.03,91.65) ; 58.29,13.24 59.82,11.72 62.61,11.72 ; 58.29,13.24 58.29,13.75 ; 58.29,13.24 61.09,13.24 62.61,11.72 ; 58.29,13.24 3.3VEXT.1 ; LED14.2 LED13.2 LED12.2 LED11.2 ; v1(119.62,53.77) 120.89,52.5 120.89,51.48 U18.14 120.92,50.44 119.42,48.94 111.11,48.94 110.09,49.96 ; 85.68,51.48 85.68,53.51 84.41,54.78 v1(84.41,56.56) ; 85.68,51.48 79.07,51.48 v1(78.93,51.33) ; 91.46,51.48 v1(91.96,50.97) ; U39.8 109.97,42.34 ; U39.8 110.18,42.13 ; 75.61,14.86 75.61,14.36 78.4,11.56 87.86,11.56 89.39,13.09 89.39,18.81 C3.2 ; 75.61,14.86 v1(74.84,14.1) 5VEXT.1 72.46,11.72 62.61,11.72 ; 75.61,14.86 76.39,15.65 C2.2 76.11,21.1 76.11,20.96 76.37,20.71 v1(76.37,17.91) ; 58.29,13.75 60.83,16.29 C1.2 58.29,18.83 58.29,13.75 ; 169.77,114.22 169.77,112.1 171.27,110.6 171.27,109.08 169.75,107.56 169.75,102.22 C4.2 164.41,95.9 163.72,95.21 ; 169.77,114.22 ETHERNET.9 ; 163.21,94.7 163.72,95.21 ; 110.18,42.13 U39.7 ; 110.18,42.13 109.97,42.34 ; 112.17,100.23 U2.12 ; 112.17,100.23 112.17,100.25 ; C3.2 81.1,21.37 v1(80.43,20.71) ; C3.2 v1(93.47,19.85) ; C3.2 76.71,36.61 ; v1(112.55,114.91) U16.12 112.8,116.82 112.8,115.55 v1(113.31,115.04) ; 3.3VEXT.1 50.9,5.72 44.05,5.72 CR2032.2 51.4,13.09 3.3VEXT.1 ; 163.72,95.21 167.02,91.9 LED16.2 163.86,95.21 163.72,95.21 ; v1(143.45,14.1) U8.2 U4.2 ; LED8.2 LED9.2 LED10.2 ; U4.2 150.56,14.27 v1(150.53,14.27) ; U4.2 U41.2 U40.2 ; LED10.2 127.52,93.17 127.78,93.17 ; LED10.2 126.51,91.9 127.78,93.17 ; 70.83,91.9 LED1.2 72.07,91.9 72.83,92.67 ; 70.83,91.9 70.76,91.97 70.76,92.74 v1(63.4,100.1) ; 72.83,92.67 72.83,104.47 ; 73.09,40.23 CN11.2 ; 73.09,40.23 76.71,36.61 ; 109.97,42.34 v1(107.43,42.34) ; 110.09,49.96 v1(110.6,50.47) ; GND.1 GND.2 GND.3 GND.4 ; 72.83,104.47 I2C1-A2.3 ; v1(120.68,122.91) 122.45,122.91 122.71,123.17 122.86,123.17 CN68.2 125.6,122.96 v1(125.86,123.22) ; v1(115.68,68.5) 116.06,68.5 CN80.1 ; v1(116.65,19.69) U5.2
  Inner2 w0.254: v1(125.86,123.22) 126.11,122.96 ; 126.11,122.96 128.65,122.96 ; 126.11,122.96 CN68.2 119.61,122.96 ; 49.15,123.24 49.15,126.28 48.39,127.05 28.58,127.05 26.92,125.4 26.8,125.4 ; 49.15,123.24 v1(49.91,123.24) I2CX-A2.3 51.69,122.73 65.37,122.73 66.58,121.52 ; 49.15,123.24 I2CX-A1.3 47.88,123.24 ; 26.8,125.4 26.29,124.89 25.53,124.89 22.99,122.35 15.88,122.35 ; 26.8,125.4 U43.2 ; v1(53.41,91.9) 60.78,91.9 v1(61.03,91.65) ; 68.77,44.22 66.74,46.25 65.72,46.25 v1(65.21,46.76) ; 68.77,44.22 75.88,51.33 v1(78.93,51.33) ; 68.77,44.22 68.51,43.97 68.51,43.46 69.02,42.95 70.55,42.95 CN11.2 CN12.2 80.43,40.26 80.43,39.5 81.45,38.49 81.45,34.93 80.43,33.91 v1(80.43,20.71) 79.16,19.44 77.89,19.44 v1(76.37,17.91) ; CN78.1 105.14,71.04 105.39,71.04 v1(106.92,69.52) ; CN78.1 CN79.1 ; CN78.1 CN77.1 ; 143.62,71.17 139.81,67.36 138.79,67.36 138.29,67.86 138.29,68.12 137.27,69.13 ; 143.62,71.17 144.89,71.17 ; 143.62,71.17 CN83.1 ; 113.14,65.07 119.36,58.85 119.36,54.02 v1(119.62,53.77) 119.36,53.51 119.36,49.19 118.86,48.69 113.78,48.69 v1(107.43,42.34) 101.84,42.34 ; 113.14,65.07 113.14,66.85 ; 113.14,65.07 113.14,56.81 v1(113.9,56.05) 114.16,55.8 114.16,55.67 ; 113.14,65.07 113.01,65.2 113.01,66.72 ; 152.76,71.17 152.76,73.96 153.27,74.47 156.07,74.47 159.37,71.17 159.62,71.17 ; 152.76,71.17 CN84.1 144.89,71.17 ; 152.76,71.17 CN85.1 ; 70.98,71.17 CN73.1 ; 70.98,71.17 71.99,71.17 ; 70.98,71.17 70.76,71.17 CN73.1 ; CN73.1 66.9,67.3 64.36,67.3 63.59,68.06 63.59,69.88 CN72.1 ; 114.58,118.34 114.58,118.22 113.31,116.94 ; 114.58,118.34 115.09,118.85 115.09,119.48 ; 114.58,118.34 114.58,118.98 ; 114.58,118.34 113.31,117.07 113.31,116.94 ; 66.58,121.52 I2C2-A0.3 ; 66.58,121.52 66.71,121.65 69.5,121.65 I2C2-A1.3 69.8,121.35 I2C2-A2.3 74.54,122.96 CN64.2 v1(83.35,122.96) v1(87.93,122.96) CN65.2 CN66.2 CN67.2 ; 114.16,55.67 114.16,54.53 110.6,50.97 v1(110.6,50.47) ; 114.16,55.67 v1(114.28,55.55) ; 114.16,55.67 112.51,57.32 112.51,58.08 111.74,58.85 110.73,58.85 104.38,65.2 102.85,65.2 99.3,68.75 99.3,70.02 CN77.1 ; 115.09,119.48 118.56,122.96 119.61,122.96 ; 115.09,119.48 114.58,118.98 ; 115.09,119.48 115.09,120.63 115.6,121.14 115.6,122.91 ; 144.89,71.17 144.89,68.12 145.65,67.36 146.67,67.36 148.96,69.64 v1(148.96,69.9) ; v1(113.31,115.04) 113.31,116.94 ; 113.31,116.94 112.55,116.18 v1(112.55,114.91) ; 107.52,122.96 107.72,123.17 109.75,123.17 111.02,124.44 114.33,124.44 115.6,123.17 115.6,122.91 ; 107.52,122.96 110.59,122.96 114.58,118.98 ; 107.52,122.96 107.47,122.91 106.96,122.91 CN67.2 ; 107.52,122.96 CN67.2 ; 42.92,83.94 45.11,86.13 45.11,88.16 45.62,88.67 v1(45.62,88.93) ; 42.92,83.94 39.11,87.75 SONAR0.2 34.67,92.23 v1(27.56,92.23) 27.31,91.97 25.78,91.97 19.18,85.37 v1(19.18,84.1) ; 42.92,83.94 41.9,82.92 41.9,82.41 42.15,82.16 42.15,78.86 v1(41.9,78.6) ; 113.14,66.85 113.14,68.75 ; 113.14,66.85 114.79,68.5 ; 113.14,66.85 113.01,66.72 ; 137.27,69.13 133.21,65.07 132.95,65.07 132.7,64.82 131.94,64.82 131.18,65.58 v1(131.18,67.36) ; 137.27,69.13 CN83.1 ; v1(124.89,106.2) CN18.2 122.83,106.15 116.74,106.15 114.45,103.86 ; 80.71,106.09 78.77,106.09 78.01,105.33 73.69,105.33 I2C1-A2.3 I2C1-A1.3 I2C1-A0.3 66.45,104.42 66.45,103.15 v1(63.4,100.1) ; 80.71,106.09 CN14.2 ; 80.71,106.09 84.02,106.09 v1(84.27,105.84) ; 115.6,122.91 116.61,122.91 116.87,123.17 119.41,123.17 119.61,122.96 ; SONAR2.2 v1(31.88,55.91) ; SONAR2.2 38.99,63.13 40.14,64.29 40.14,67.08 v1(45.22,72.16) ; SONAR2.2 39.12,62.89 43.18,62.89 ; CN87.1 163.18,74.72 160.13,74.72 159.62,74.21 159.62,71.17 ; v1(65.07,41.76) 48.56,58.27 48.56,61.57 SONAR3.2 46.99,62.64 43.94,62.64 43.69,62.89 43.18,62.89 ; CN76.1 CN75.1 ; CN76.1 91.27,71.14 91.01,71.14 89.49,69.61 89.49,69.36 89.24,69.1 ; CN76.1 91.55,71.42 97.9,71.42 CN77.1 ; CN75.1 84.66,71.14 86.95,71.14 88.22,69.87 88.47,69.87 89.24,69.1 ; CN75.1 CN74.1 71.99,71.17 ; 71.99,71.17 71.99,68.12 71.23,67.36 69.96,67.36 v1(69.2,66.59) ; 101.84,42.34 101.84,46.66 102.09,46.91 101.84,47.16 101.84,48.69 101.58,48.94 v1(101.58,50.21) ; 101.84,42.34 101.84,41.32 101.08,40.56 99.3,40.56 99.15,40.41 CN10.2 ; 119.61,122.96 119.66,122.91 v1(120.68,122.91) ; v1(84.41,56.56) 85.43,57.58 85.43,57.83 89.49,61.89 89.49,68.75 89.24,69.01 89.24,69.1 ; 113.01,66.72 112.25,67.48 111.49,67.48 111.24,67.74 110.98,67.74 110.98,67.99 110.73,68.25 110.73,69.01 ; v1(50.73,69.11) 51.5,69.11 53.53,67.08 53.53,56.92 58.86,51.59 60.39,51.59 v1(61.66,50.32) ; v1(52.48,98.58) 51.71,99.34 51.71,100.36 50.95,101.12 50.95,102.13 49.68,103.4 ; 121.79,21.64 125.82,21.64 U42.2 ; 121.79,21.64 121.79,22.91 127.13,28.24 127.13,36.88 v1(126.87,37.13) ; 121.79,21.64 121.79,21.02 U6.2 ; 113.14,68.75 114.41,68.75 114.66,68.5 114.79,68.5 ; 113.14,68.75 113.14,69.9 CN79.1 ; CN79.1 110.98,70.28 110.98,69.26 110.73,69.01 ; v1(93.47,19.85) 94.49,19.85 94.65,19.69 U5.2 v1(116.65,19.69) U6.2 ; CN83.1 CN82.1 v1(131.18,71.17) ; U6.2 U42.2 ; 114.79,68.5 116.32,70.02 116.32,70.53 116.95,71.17 CN80.1 v1(120.76,69.13) ; 114.79,68.5 v1(115.68,68.5) ; 43.18,62.89 43.18,64.42 42.42,65.18 v1(42.42,65.69) ; v1(112.42,99.04) 113.18,99.04 114.2,100.05 114.2,102.59 114.45,102.85 114.45,103.86 ; 89.39,13.09 80.69,13.09 79.42,11.82 79.16,11.82 78.91,11.56 78.65,11.82 77.13,11.82 v1(74.84,14.1) ; 128.65,122.96 128.91,123.22 129.92,123.22 130.18,122.96 ; 128.65,122.96 130.18,122.96 ; 14.86,121.33 13.84,122.35 ; 14.86,121.33 18.42,117.78 18.42,113.47 19.18,112.71 20.19,112.71 20.45,112.97 20.95,112.97 20.95,113.1 U47.4 ; 14.86,121.33 15.88,122.35 ; v1(102.16,93.94) 102.92,93.17 103.43,93.17 v1(104.19,93.94) ; 159.62,71.17 CN86.1 ; v1(41.81,92.74) 46.89,97.82 46.89,101.88 47.4,102.39 47.65,102.39 48.67,103.4 49.68,103.4 ; 47.88,123.24 I2CX-A0.3 44.83,123.36 44.83,123.49 46.1,124.76 46.36,124.76 47.88,123.24 ; 114.45,103.86 112.67,105.64 109.63,105.64 108.86,104.88 108.1,104.88 107.85,105.13 107.59,105.13 106.83,105.9 CN17.2 ; 15.88,122.35 12.06,126.16 12.06,126.66 11.05,127.68 10.29,127.68 10.03,127.94 U44.1 ; 130.18,122.96 CN69.2 CN70.2 CN71.2 ; v1(149,37.64) CN59.2 CN60.2 CN61.2 v1(130.18,37.64) ; 49.68,103.4 49.68,103.58 50.95,104.85 50.95,105.35 50.7,105.61 50.44,105.61 v1(50.19,105.86) ; U42.2 133.35,14.1 v1(143.45,14.1) ; 110.73,69.01 v1(109.46,69.01)
  Bottom Layer w0.254: v1(41.81,92.74) v1(45.62,88.93) 46.63,87.91 SONAR1.2 ; v1(130.18,37.64) CN62.2 CN63.2 118.86,37.76 117.84,37.76 116.57,39.03 110.73,39.03 v1(107.43,42.34) ; v1(131.18,71.17) v1(131.18,67.36) ; v1(131.18,71.17) CN81.1 121.78,67.36 ; v1(131.18,71.17) CN82.1 ; v1(42.51,77.08) 42.68,77.24 46.42,77.24 53.27,70.38 53.27,67.34 53.53,67.08 53.27,66.83 53.27,66.57 53.02,66.32 52.51,66.32 50.73,68.1 v1(50.73,69.11) 50.48,69.37 49.97,69.37 47.94,71.4 46.42,71.4 45.91,71.91 45.48,71.91 ; 45.48,71.91 v1(45.22,72.16) ; 45.48,71.91 45.48,70.89 44.46,69.88 44.46,66.07 47.25,63.27 47.25,63.02 SONAR3.2 ; 151.8,37.64 CN58.2 CN57.2 CN56.2 ; 151.8,37.64 v1(149.76,37.64) v1(149,37.64) ; 151.8,37.64 151.8,32.05 153.83,30.02 153.83,21.89 153.07,21.13 152.31,21.13 147.99,16.81 ; v1(49.91,123.24) I2CX-A2.3 59.28,123.24 59.72,122.79 60.48,122.79 60.74,123.05 v1(61.25,123.05) ; v1(120.76,69.13) 120.76,67.86 121.27,67.36 121.78,67.36 ; 121.78,67.36 121.65,67.23 116.95,67.23 v1(115.68,68.5) ; v1(43.18,77.11) 46.48,77.11 48.01,75.59 48.01,75.08 42.42,69.5 v1(42.42,65.69) ; CN21.2 149.33,105.95 149.33,105.18 150.34,104.17 150.34,103.41 149.58,102.64 149.33,102.64 149.07,102.39 148.82,102.64 148.56,102.64 145.01,106.2 v1(142.97,106.2) CN20.2 CN19.2 v1(124.89,106.2) CN18.2 ; 114.98,109.05 114.98,111.97 113.06,113.9 ; 114.98,109.05 115.09,108.94 115.09,106.4 114.33,105.64 114.33,100.31 113.06,99.04 v1(112.42,99.04) ; 114.98,109.05 113.06,110.98 113.06,113.9 ; 114.98,109.05 114.98,106.38 112.19,103.59 111.17,103.59 ; v1(119.62,53.77) 119.11,54.28 117.33,54.28 116.82,54.78 114.79,54.78 114.28,55.29 v1(114.28,55.55) ; CN15.2 CN16.2 CN17.2 106.96,106.38 108.38,106.38 111.17,103.59 ; CN15.2 CN14.2 ; CN15.2 89.35,106.09 84.52,106.09 v1(84.27,105.84) ; v1(83.35,122.96) 86.91,122.96 87.16,122.71 87.42,122.71 87.67,122.96 v1(87.93,122.96) ; v1(91.96,50.97) 92.47,51.48 PWM-A2.3 PWM-A3.3 PWM-A4.3 101.33,51.48 ; v1(111.17,100.54) 111.17,103.59 ; 113.06,113.9 112.55,114.41 v1(112.55,114.91) ; 113.06,113.9 113.06,114.02 113.31,114.28 v1(113.31,115.04) ; v1(64.16,95.02) 64.16,99.34 v1(63.4,100.1) 63.14,100.1 62.89,100.36 51.97,100.36 51.71,100.1 51.71,99.34 v1(52.48,98.58) ; 147.99,16.81 v1(150.53,14.27) ; 147.99,16.81 146.46,15.29 146.46,13.51 U8.2 ; v1(27.56,92.23) 26.8,92.23 26.8,92.38 U43.15 ; v1(109.46,69.01) 109.46,70.78 109.2,71.04 108.44,71.04 v1(106.92,69.52) ; 101.33,51.48 101.33,50.97 101.58,50.72 v1(101.58,50.21) ; 101.33,51.48 PWM-A5.3 ; v1(65.21,46.76) v1(61.66,50.32) ; v1(76.37,17.91) 76.37,15.63 v1(74.84,14.1) ; CN87.1 CN86.1 157.34,71.17 153.53,67.36 152.51,67.36 149.97,69.9 v1(148.96,69.9) ; U48.3 19.18,83.74 v1(19.18,84.1) ; v1(69.2,66.59) CN72.1
